# EAGLE schematic lost60V3 (EAGLE 9.6.0)

## Sheet 1 of 8
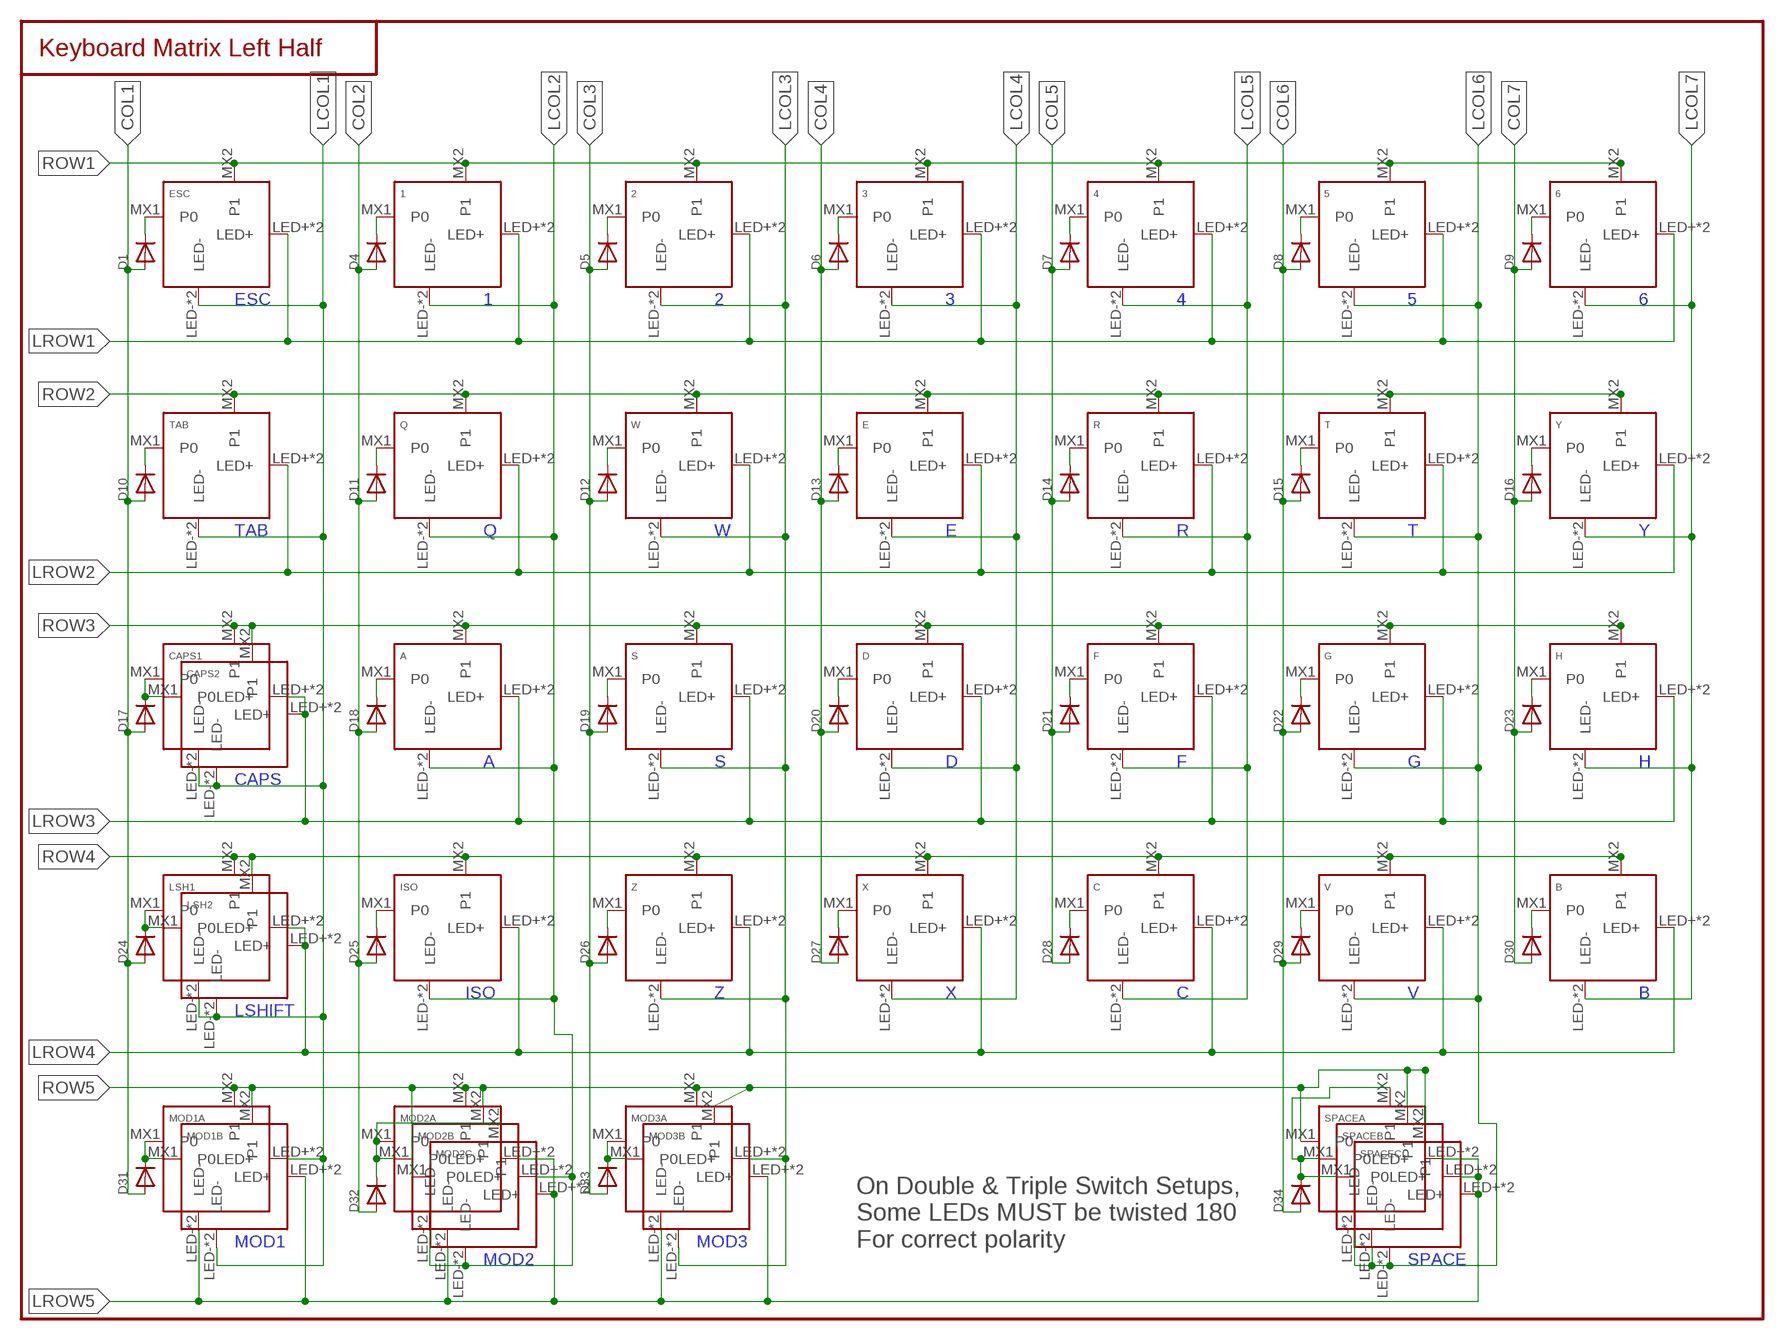
[diagram p0: schematic, sheet 1]

### Parts
1  KEYSWITCH-THTSMDLED-MX-1U-THTSMDLED  [MX-1U-THTSMDLED]
2  KEYSWITCH-THTSMDLED-MX-1U-THTSMDLED  [MX-1U-THTSMDLED]
3  KEYSWITCH-THTSMDLED-MX-1U-THTSMDLED  [MX-1U-THTSMDLED]
4  KEYSWITCH-THTSMDLED-MX-1U-THTSMDLED  [MX-1U-THTSMDLED]
5  KEYSWITCH-THTSMDLED-MX-1U-THTSMDLED  [MX-1U-THTSMDLED]
6  KEYSWITCH-THTSMDLED-MX-1U-THTSMDLED  [MX-1U-THTSMDLED]
A  KEYSWITCH-THTSMDLED-MX-1U-THTSMDLED  [MX-1U-THTSMDLED]
B  KEYSWITCH-THTSMDLED-MX-1U-THTSMDLED  [MX-1U-THTSMDLED]
C  KEYSWITCH-THTSMDLED-MX-1U-THTSMDLED  [MX-1U-THTSMDLED]
CAPS1  KEYSWITCH-THTSMDLED-MX-1U-THTSMDLED  [MX-1U-THTSMDLED]
CAPS2  KEYSWITCH-THTSMDLED-MX-1U-THTSMDLED  [MX-1U-THTSMDLED]
D  KEYSWITCH-THTSMDLED-MX-1U-THTSMDLED  [MX-1U-THTSMDLED]
D1  DIODESOD-523  [SOD-523]
D4  DIODESOD-523  [SOD-523]
D5  DIODESOD-523  [SOD-523]
D6  DIODESOD-523  [SOD-523]
D7  DIODESOD-523  [SOD-523]
D8  DIODESOD-523  [SOD-523]
D9  DIODESOD-523  [SOD-523]
D10  DIODESOD-523  [SOD-523]
D11  DIODESOD-523  [SOD-523]
D12  DIODESOD-523  [SOD-523]
D13  DIODESOD-523  [SOD-523]
D14  DIODESOD-523  [SOD-523]
D15  DIODESOD-523  [SOD-523]
D16  DIODESOD-523  [SOD-523]
D17  DIODESOD-523  [SOD-523]
D18  DIODESOD-523  [SOD-523]
D19  DIODESOD-523  [SOD-523]
D20  DIODESOD-523  [SOD-523]
D21  DIODESOD-523  [SOD-523]
D22  DIODESOD-523  [SOD-523]
D23  DIODESOD-523  [SOD-523]
D24  DIODESOD-523  [SOD-523]
D25  DIODESOD-523  [SOD-523]
D26  DIODESOD-523  [SOD-523]
D27  DIODESOD-523  [SOD-523]
D28  DIODESOD-523  [SOD-523]
D29  DIODESOD-523  [SOD-523]
D30  DIODESOD-523  [SOD-523]
D31  DIODESOD-523  [SOD-523]
D32  DIODESOD-523  [SOD-523]
D33  DIODESOD-523  [SOD-523]
D34  DIODESOD-523  [SOD-523]
E  KEYSWITCH-THTSMDLED-MX-1U-THTSMDLED  [MX-1U-THTSMDLED]
ESC  KEYSWITCH-THTSMDLED-MX-1U-THTSMDLED  [MX-1U-THTSMDLED]
F  KEYSWITCH-THTSMDLED-MX-1U-THTSMDLED  [MX-1U-THTSMDLED]
G  KEYSWITCH-THTSMDLED-MX-1U-THTSMDLED  [MX-1U-THTSMDLED]
H  KEYSWITCH-THTSMDLED-MX-1U-THTSMDLED  [MX-1U-THTSMDLED]
ISO  KEYSWITCH-THTSMDLED-MX-1U-THTSMDLED  [MX-1U-THTSMDLED]
LSH1  KEYSWITCH-THTSMDLED-MX-1U-THTSMDLED  [MX-1U-THTSMDLED]
LSH2  KEYSWITCH-THTSMDLED-MX-2U-THTSMDLED  [MX-2U-THTSMDLED]
MOD1A  KEYSWITCH-THTSMDLED-MX-1U-THTSMDLED  [MX-1U-THTSMDLED]
MOD1B  KEYSWITCH-THTSMDLED-MX-1U-THTSMDLED  [MX-1U-THTSMDLED]
MOD2A  KEYSWITCH-THTSMDLED-MX-1U-THTSMDLED  [MX-1U-THTSMDLED]
MOD2B  KEYSWITCH-THTSMDLED-MX-1U-THTSMDLED  [MX-1U-THTSMDLED]
MOD2C  KEYSWITCH-THTSMDLED-MX-1U-THTSMDLED  [MX-1U-THTSMDLED]
MOD3A  KEYSWITCH-THTSMDLED-MX-1U-THTSMDLED  [MX-1U-THTSMDLED]
MOD3B  KEYSWITCH-THTSMDLED-MX-1U-THTSMDLED  [MX-1U-THTSMDLED]
Q  KEYSWITCH-THTSMDLED-MX-1U-THTSMDLED  [MX-1U-THTSMDLED]
R  KEYSWITCH-THTSMDLED-MX-1U-THTSMDLED  [MX-1U-THTSMDLED]
S  KEYSWITCH-THTSMDLED-MX-1U-THTSMDLED  [MX-1U-THTSMDLED]
SPACEA  KEYSWITCH-THTSMDLED-MX-6.25U-THTSMDLED-FLIPPED  [MX-6.25U-THTSMDLED-FLIPPED]
SPACEB  KEYSWITCH-THTSMDLED-MX-7U-THTSMDLED-FLIPPED  [MX-7U-THTSMDLED-FLIPPED]
SPACEC  KEYSWITCH-THTSMDLED-MX-7U-THTSMDLED-FLIPPED  [MX-7U-THTSMDLED-FLIPPED]
T  KEYSWITCH-THTSMDLED-MX-1U-THTSMDLED  [MX-1U-THTSMDLED]
TAB  KEYSWITCH-THTSMDLED-MX-1U-THTSMDLED  [MX-1U-THTSMDLED]
V  KEYSWITCH-THTSMDLED-MX-1U-THTSMDLED  [MX-1U-THTSMDLED]
W  KEYSWITCH-THTSMDLED-MX-1U-THTSMDLED  [MX-1U-THTSMDLED]
X  KEYSWITCH-THTSMDLED-MX-1U-THTSMDLED  [MX-1U-THTSMDLED]
Y  KEYSWITCH-THTSMDLED-MX-1U-THTSMDLED  [MX-1U-THTSMDLED]
Z  KEYSWITCH-THTSMDLED-MX-1U-THTSMDLED  [MX-1U-THTSMDLED]

### Nets
COL1: D1.A D10.A D17.A D24.A D31.A ; also sheet 4
COL2: D4.A D11.A D18.A D25.A D32.A ; also sheet 4
COL3: D5.A D12.A D19.A D26.A D33.A ; also sheet 4
COL4: D6.A D13.A D20.A D27.A ; also sheet 4
COL5: D7.A D14.A D21.A D28.A ; also sheet 4
COL6: D8.A D15.A D22.A D29.A D34.A ; also sheet 4
COL7: D9.A D16.A D23.A D30.A ; also sheet 4
LCOL1: CAPS1.LED- CAPS1.SMDLED-(LED-) CAPS2.LED- CAPS2.SMDLED-(LED-) ESC.LED- ESC.SMDLED-(LED-) LSH1.LED- LSH1.SMDLED-(LED-) LSH2.LED- LSH2.SMDLED-(LED-) MOD1A.LED+ MOD1A.SMDLED+(LED+) MOD1B.LED- MOD1B.SMDLED-(LED-) TAB.LED- TAB.SMDLED-(LED-) ; also sheet 8
LCOL2: 1.LED- 1.SMDLED-(LED-) A.LED- A.SMDLED-(LED-) ISO.LED- ISO.SMDLED-(LED-) MOD2A.LED- MOD2A.SMDLED-(LED-) MOD2B.LED+ MOD2B.SMDLED+(LED+) MOD2C.LED- MOD2C.SMDLED-(LED-) Q.LED- Q.SMDLED-(LED-) ; also sheet 8
LCOL3: 2.LED- 2.SMDLED-(LED-) MOD3A.LED+ MOD3A.SMDLED+(LED+) MOD3B.LED- MOD3B.SMDLED-(LED-) S.LED- S.SMDLED-(LED-) W.LED- W.SMDLED-(LED-) Z.LED- Z.SMDLED-(LED-) ; also sheet 8
LCOL4: 3.LED- 3.SMDLED-(LED-) D.LED- D.SMDLED-(LED-) E.LED- E.SMDLED-(LED-) X.LED- X.SMDLED-(LED-) ; also sheet 8
LCOL5: 4.LED- 4.SMDLED-(LED-) C.LED- C.SMDLED-(LED-) F.LED- F.SMDLED-(LED-) R.LED- R.SMDLED-(LED-) ; also sheet 8
LCOL6: 5.LED- 5.SMDLED-(LED-) G.LED- G.SMDLED-(LED-) SPACEA.LED- SPACEA.SMDLED-(LED-) SPACEB.LED- SPACEB.SMDLED-(LED-) SPACEC.LED- SPACEC.SMDLED-(LED-) T.LED- T.SMDLED-(LED-) V.LED- V.SMDLED-(LED-) ; also sheet 8
LCOL7: 6.LED- 6.SMDLED-(LED-) B.LED- B.SMDLED-(LED-) H.LED- H.SMDLED-(LED-) Y.LED- Y.SMDLED-(LED-) ; also sheet 8
LROW1: 1.LED+ 1.SMDLED+(LED+) 2.LED+ 2.SMDLED+(LED+) 3.LED+ 3.SMDLED+(LED+) 4.LED+ 4.SMDLED+(LED+) 5.LED+ 5.SMDLED+(LED+) 6.LED+ 6.SMDLED+(LED+) ESC.LED+ ESC.SMDLED+(LED+) ; also sheet 2,8
LROW2: E.LED+ E.SMDLED+(LED+) Q.LED+ Q.SMDLED+(LED+) R.LED+ R.SMDLED+(LED+) T.LED+ T.SMDLED+(LED+) TAB.LED+ TAB.SMDLED+(LED+) W.LED+ W.SMDLED+(LED+) Y.LED+ Y.SMDLED+(LED+) ; also sheet 2,8
LROW3: A.LED+ A.SMDLED+(LED+) CAPS1.LED+ CAPS1.SMDLED+(LED+) CAPS2.LED+ CAPS2.SMDLED+(LED+) D.LED+ D.SMDLED+(LED+) F.LED+ F.SMDLED+(LED+) G.LED+ G.SMDLED+(LED+) H.LED+ H.SMDLED+(LED+) S.LED+ S.SMDLED+(LED+) ; also sheet 2,8
LROW4: B.LED+ B.SMDLED+(LED+) C.LED+ C.SMDLED+(LED+) ISO.LED+ ISO.SMDLED+(LED+) LSH1.LED+ LSH1.SMDLED+(LED+) LSH2.LED+ LSH2.SMDLED+(LED+) V.LED+ V.SMDLED+(LED+) X.LED+ X.SMDLED+(LED+) Z.LED+ Z.SMDLED+(LED+) ; also sheet 2,8
LROW5: MOD1A.LED- MOD1A.SMDLED-(LED-) MOD1B.LED+ MOD1B.SMDLED+(LED+) MOD2A.LED+ MOD2A.SMDLED+(LED+) MOD2B.LED- MOD2B.SMDLED-(LED-) MOD2C.LED+ MOD2C.SMDLED+(LED+) MOD3A.LED- MOD3A.SMDLED-(LED-) MOD3B.LED+ MOD3B.SMDLED+(LED+) SPACEA.LED+ SPACEA.SMDLED+(LED+) SPACEB.LED+ SPACEB.SMDLED+(LED+) SPACEC.LED+ SPACEC.SMDLED+(LED+) ; also sheet 2,8
N$20: D1.K(C) ESC.MX1(P0)
N$27: 1.MX1(P0) D4.K(C)
N$30: 2.MX1(P0) D5.K(C)
N$31: 3.MX1(P0) D6.K(C)
N$32: 4.MX1(P0) D7.K(C)
N$33: 5.MX1(P0) D8.K(C)
N$34: 6.MX1(P0) D9.K(C)
N$35: D10.K(C) TAB.MX1(P0)
N$36: D11.K(C) Q.MX1(P0)
N$37: D12.K(C) W.MX1(P0)
N$38: D13.K(C) E.MX1(P0)
N$39: D14.K(C) R.MX1(P0)
N$40: D15.K(C) T.MX1(P0)
N$41: D16.K(C) Y.MX1(P0)
N$42: D34.K(C) SPACEA.MX2(P1) SPACEB.MX1(P0) SPACEC.MX1(P0)
N$46: CAPS1.MX1(P0) CAPS2.MX1(P0) D17.K(C)
N$48: A.MX1(P0) D18.K(C)
N$50: D19.K(C) S.MX1(P0)
N$51: D20.K(C) D.MX1(P0)
N$52: D21.K(C) F.MX1(P0)
N$53: D23.K(C) H.MX1(P0)
N$54: D24.K(C) LSH1.MX1(P0) LSH2.MX1(P0)
N$55: D25.K(C) ISO.MX1(P0)
N$56: D26.K(C) Z.MX1(P0)
N$57: D27.K(C) X.MX1(P0)
N$58: C.MX1(P0) D28.K(C)
N$59: D29.K(C) V.MX1(P0)
N$60: B.MX1(P0) D30.K(C)
N$61: D31.K(C) MOD1A.MX1(P0) MOD1B.MX1(P0)
N$62: D32.K(C) MOD2A.MX1(P0) MOD2B.MX1(P0) MOD2C.MX2(P1)
N$63: D33.K(C) MOD3A.MX1(P0) MOD3B.MX1(P0)
N$65: D22.K(C) G.MX1(P0)
ROW1: 1.MX2(P1) 2.MX2(P1) 3.MX2(P1) 4.MX2(P1) 5.MX2(P1) 6.MX2(P1) ESC.MX2(P1) ; also sheet 2,3
ROW2: E.MX2(P1) Q.MX2(P1) R.MX2(P1) T.MX2(P1) TAB.MX2(P1) W.MX2(P1) Y.MX2(P1) ; also sheet 2,3
ROW3: A.MX2(P1) CAPS1.MX2(P1) CAPS2.MX2(P1) D.MX2(P1) F.MX2(P1) G.MX2(P1) H.MX2(P1) S.MX2(P1) ; also sheet 2,3
ROW4: B.MX2(P1) C.MX2(P1) ISO.MX2(P1) LSH1.MX2(P1) LSH2.MX2(P1) V.MX2(P1) X.MX2(P1) Z.MX2(P1) ; also sheet 2,3
ROW5: MOD1A.MX2(P1) MOD1B.MX2(P1) MOD2A.MX2(P1) MOD2B.MX2(P1) MOD2C.MX1(P0) MOD3A.MX2(P1) MOD3B.MX2(P1) SPACEA.MX1(P0) SPACEB.MX2(P1) SPACEC.MX2(P1) ; also sheet 2,3,4

### Notes on the sheet
- Keyboard Matrix Left Half
- ESC | 1 | 2 | 3 | 4 | 5 | 6
- TAB | Q | W | E | R | T | Y
- A | S | D | F | G | H
- CAPS
- ISO | Z | X | C | V | B
- LSHIFT
- MOD1 | MOD3
- On Double & Triple Switch Setups, 
  Some LEDs MUST be twisted 180 
  For correct polarity
- MOD2 | SPACE

## Sheet 2 of 8
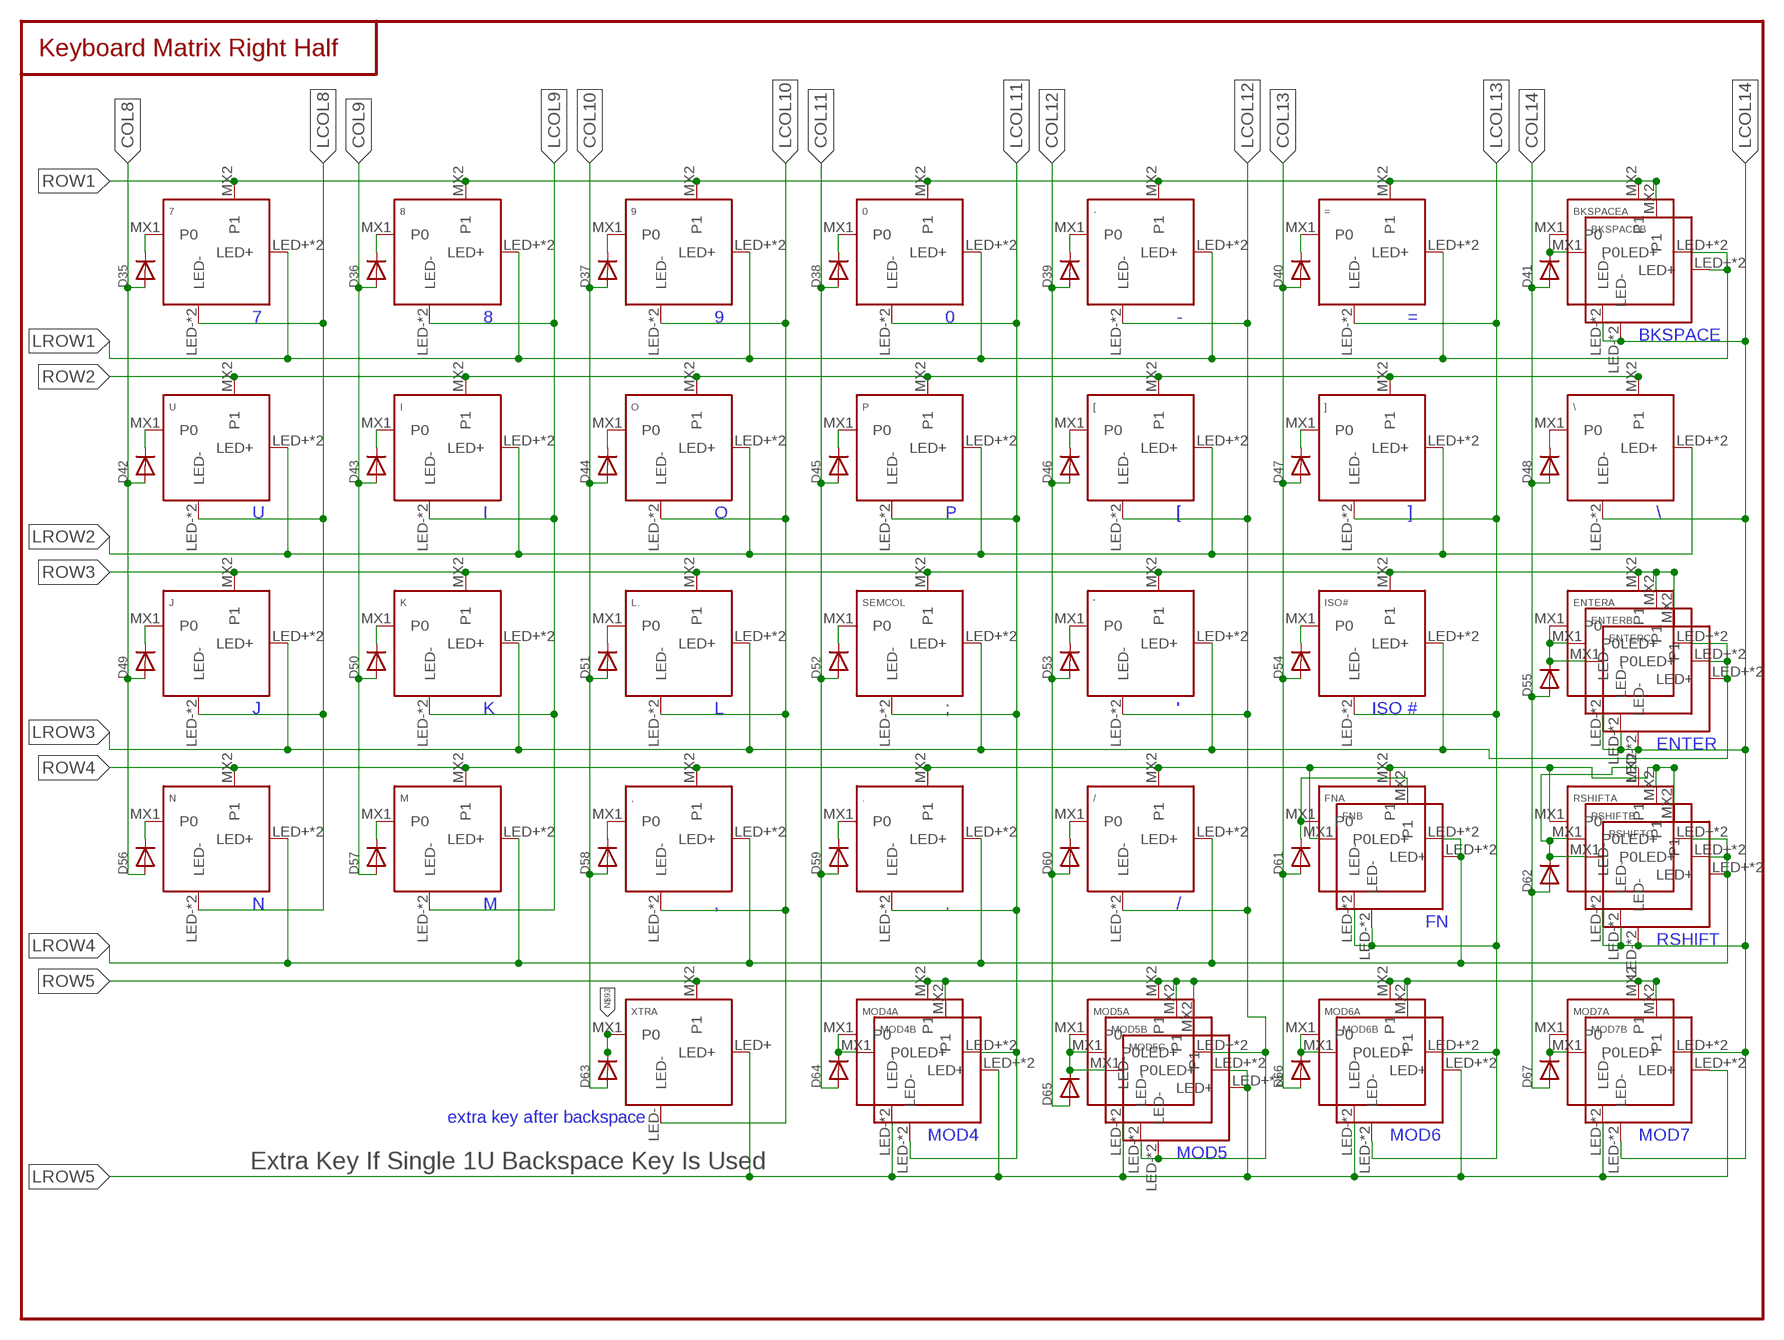
[diagram p1: schematic, sheet 2]

### Parts
0  KEYSWITCH-THTSMDLED-MX-1U-THTSMDLED  [MX-1U-THTSMDLED]
7  KEYSWITCH-THTSMDLED-MX-1U-THTSMDLED  [MX-1U-THTSMDLED]
8  KEYSWITCH-THTSMDLED-MX-1U-THTSMDLED  [MX-1U-THTSMDLED]
9  KEYSWITCH-THTSMDLED-MX-1U-THTSMDLED  [MX-1U-THTSMDLED]
'  KEYSWITCH-THTSMDLED-MX-1U-THTSMDLED  [MX-1U-THTSMDLED]
,  KEYSWITCH-THTSMDLED-MX-1U-THTSMDLED  [MX-1U-THTSMDLED]
-  KEYSWITCH-THTSMDLED-MX-1U-THTSMDLED  [MX-1U-THTSMDLED]
.  KEYSWITCH-THTSMDLED-MX-1U-THTSMDLED  [MX-1U-THTSMDLED]
/  KEYSWITCH-THTSMDLED-MX-1U-THTSMDLED  [MX-1U-THTSMDLED]
=  KEYSWITCH-THTSMDLED-MX-1U-THTSMDLED  [MX-1U-THTSMDLED]
[  KEYSWITCH-THTSMDLED-MX-1U-THTSMDLED  [MX-1U-THTSMDLED]
\  KEYSWITCH-THTSMDLED-MX-1U-THTSMDLED  [MX-1U-THTSMDLED]
]  KEYSWITCH-THTSMDLED-MX-1U-THTSMDLED  [MX-1U-THTSMDLED]
BKSPACEA  KEYSWITCH-THTSMDLED-MX-1U-THTSMDLED  [MX-1U-THTSMDLED]
BKSPACEB  KEYSWITCH-THTSMDLED-MX-2U-THTSMDLED  [MX-2U-THTSMDLED]
D35  DIODESOD-523  [SOD-523]
D36  DIODESOD-523  [SOD-523]
D37  DIODESOD-523  [SOD-523]
D38  DIODESOD-523  [SOD-523]
D39  DIODESOD-523  [SOD-523]
D40  DIODESOD-523  [SOD-523]
D41  DIODESOD-523  [SOD-523]
D42  DIODESOD-523  [SOD-523]
D43  DIODESOD-523  [SOD-523]
D44  DIODESOD-523  [SOD-523]
D45  DIODESOD-523  [SOD-523]
D46  DIODESOD-523  [SOD-523]
D47  DIODESOD-523  [SOD-523]
D48  DIODESOD-523  [SOD-523]
D49  DIODESOD-523  [SOD-523]
D50  DIODESOD-523  [SOD-523]
D51  DIODESOD-523  [SOD-523]
D52  DIODESOD-523  [SOD-523]
D53  DIODESOD-523  [SOD-523]
D54  DIODESOD-523  [SOD-523]
D55  DIODESOD-523  [SOD-523]
D56  DIODESOD-523  [SOD-523]
D57  DIODESOD-523  [SOD-523]
D58  DIODESOD-523  [SOD-523]
D59  DIODESOD-523  [SOD-523]
D60  DIODESOD-523  [SOD-523]
D61  DIODESOD-523  [SOD-523]
D62  DIODESOD-523  [SOD-523]
D63  DIODESOD-523  [SOD-523]
D64  DIODESOD-523  [SOD-523]
D65  DIODESOD-523  [SOD-523]
D66  DIODESOD-523  [SOD-523]
D67  DIODESOD-523  [SOD-523]
ENTERA  KEYSWITCH-THTSMDLED-MX-1U-THTSMDLED  [MX-1U-THTSMDLED]
ENTERB  KEYSWITCH-THTSMDLED-MX-2U-THTSMDLED  [MX-2U-THTSMDLED]
ENTERC  KEYSWITCH-THTSMDLED-MX-2U-THTSMDLED  [MX-2U-THTSMDLED]
FNA  KEYSWITCH-THTSMDLED-MX-1U-THTSMDLED  [MX-1U-THTSMDLED]
FNB  KEYSWITCH-THTSMDLED-MX-1U-THTSMDLED  [MX-1U-THTSMDLED]
I  KEYSWITCH-THTSMDLED-MX-1U-THTSMDLED  [MX-1U-THTSMDLED]
ISO#  KEYSWITCH-THTSMDLED-MX-1U-THTSMDLED  [MX-1U-THTSMDLED]
J  KEYSWITCH-THTSMDLED-MX-1U-THTSMDLED  [MX-1U-THTSMDLED]
K  KEYSWITCH-THTSMDLED-MX-1U-THTSMDLED  [MX-1U-THTSMDLED]
L.  KEYSWITCH-THTSMDLED-MX-1U-THTSMDLED  [MX-1U-THTSMDLED]
M  KEYSWITCH-THTSMDLED-MX-1U-THTSMDLED  [MX-1U-THTSMDLED]
MOD4A  KEYSWITCH-THTSMDLED-MX-1U-THTSMDLED  [MX-1U-THTSMDLED]
MOD4B  KEYSWITCH-THTSMDLED-MX-1U-THTSMDLED  [MX-1U-THTSMDLED]
MOD5A  KEYSWITCH-THTSMDLED-MX-1U-THTSMDLED  [MX-1U-THTSMDLED]
MOD5B  KEYSWITCH-THTSMDLED-MX-1U-THTSMDLED  [MX-1U-THTSMDLED]
MOD5C  KEYSWITCH-THTSMDLED-MX-1U-THTSMDLED  [MX-1U-THTSMDLED]
MOD6A  KEYSWITCH-THTSMDLED-MX-1U-THTSMDLED  [MX-1U-THTSMDLED]
MOD6B  KEYSWITCH-THTSMDLED-MX-1U-THTSMDLED  [MX-1U-THTSMDLED]
MOD7A  KEYSWITCH-THTSMDLED-MX-1U-THTSMDLED  [MX-1U-THTSMDLED]
MOD7B  KEYSWITCH-THTSMDLED-MX-1U-THTSMDLED  [MX-1U-THTSMDLED]
N  KEYSWITCH-THTSMDLED-MX-1U-THTSMDLED  [MX-1U-THTSMDLED]
O  KEYSWITCH-THTSMDLED-MX-1U-THTSMDLED  [MX-1U-THTSMDLED]
P  KEYSWITCH-THTSMDLED-MX-1U-THTSMDLED  [MX-1U-THTSMDLED]
RSHIFTA  KEYSWITCH-THTSMDLED-MX-1U-THTSMDLED  [MX-1U-THTSMDLED]
RSHIFTB  KEYSWITCH-THTSMDLED-MX-1U-THTSMDLED  [MX-1U-THTSMDLED]
RSHIFTC  KEYSWITCH-THTSMDLED-MX-2U-THTSMDLED  [MX-2U-THTSMDLED]
SEMCOL  KEYSWITCH-THTSMDLED-MX-1U-THTSMDLED  [MX-1U-THTSMDLED]
U  KEYSWITCH-THTSMDLED-MX-1U-THTSMDLED  [MX-1U-THTSMDLED]
XTRA  KEYSWITCH-THTSMDLED-MOD1  [MX-1U-THTSMDLED-MOD1]

### Nets
COL8: D35.A D42.A D49.A D56.A ; also sheet 4
COL9: D36.A D43.A D50.A D57.A ; also sheet 4
COL10: D37.A D44.A D51.A D58.A D63.A ; also sheet 4
COL11: D38.A D45.A D52.A D59.A D64.A ; also sheet 4
COL12: D39.A D46.A D53.A D60.A D65.A ; also sheet 4
COL13: D40.A D47.A D54.A D61.A D66.A ; also sheet 4
COL14: D41.A D48.A D55.A D62.A D67.A ; also sheet 4
LCOL8: 7.LED- 7.SMDLED-(LED-) J.LED- J.SMDLED-(LED-) N.LED- N.SMDLED-(LED-) U.LED- U.SMDLED-(LED-) ; also sheet 8
LCOL9: 8.LED- 8.SMDLED-(LED-) I.LED- I.SMDLED-(LED-) K.LED- K.SMDLED-(LED-) M.LED- M.SMDLED-(LED-) ; also sheet 8
LCOL10: 9.LED- 9.SMDLED-(LED-) ,.LED- ,.SMDLED-(LED-) L..LED- L..SMDLED-(LED-) O.LED- O.SMDLED-(LED-) XTRA.LED- ; also sheet 8
LCOL11: 0.LED- 0.SMDLED-(LED-) ..LED- ..SMDLED-(LED-) MOD4A.LED+ MOD4A.SMDLED+(LED+) MOD4B.LED- MOD4B.SMDLED-(LED-) P.LED- P.SMDLED-(LED-) SEMCOL.LED- SEMCOL.SMDLED-(LED-) ; also sheet 8
LCOL12: '.LED- '.SMDLED-(LED-) -.LED- -.SMDLED-(LED-) /.LED- /.SMDLED-(LED-) [.LED- [.SMDLED-(LED-) MOD5A.LED+ MOD5A.SMDLED+(LED+) MOD5B.LED- MOD5B.SMDLED-(LED-) MOD5C.LED- MOD5C.SMDLED-(LED-) ; also sheet 8
LCOL13: =.LED- =.SMDLED-(LED-) ].LED- ].SMDLED-(LED-) FNA.LED- FNA.SMDLED-(LED-) FNB.LED- FNB.SMDLED-(LED-) ISO#.LED- ISO#.SMDLED-(LED-) MOD6A.LED+ MOD6A.SMDLED+(LED+) MOD6B.LED- MOD6B.SMDLED-(LED-) ; also sheet 8
LCOL14: \.LED- \.SMDLED-(LED-) BKSPACEA.LED- BKSPACEA.SMDLED-(LED-) BKSPACEB.LED- BKSPACEB.SMDLED-(LED-) ENTERA.LED- ENTERA.SMDLED-(LED-) ENTERB.LED- ENTERB.SMDLED-(LED-) ENTERC.LED- ENTERC.SMDLED-(LED-) MOD7A.LED+ MOD7A.SMDLED+(LED+) MOD7B.LED- MOD7B.SMDLED-(LED-) RSHIFTA.LED- RSHIFTA.SMDLED-(LED-) RSHIFTB.LED- RSHIFTB.SMDLED-(LED-) RSHIFTC.LED- RSHIFTC.SMDLED-(LED-) ; also sheet 8
LROW1: 0.LED+ 0.SMDLED+(LED+) 7.LED+ 7.SMDLED+(LED+) 8.LED+ 8.SMDLED+(LED+) 9.LED+ 9.SMDLED+(LED+) -.LED+ -.SMDLED+(LED+) =.LED+ =.SMDLED+(LED+) BKSPACEA.LED+ BKSPACEA.SMDLED+(LED+) BKSPACEB.LED+ BKSPACEB.SMDLED+(LED+) ; also sheet 1,8
LROW2: [.LED+ [.SMDLED+(LED+) \.LED+ \.SMDLED+(LED+) ].LED+ ].SMDLED+(LED+) I.LED+ I.SMDLED+(LED+) O.LED+ O.SMDLED+(LED+) P.LED+ P.SMDLED+(LED+) U.LED+ U.SMDLED+(LED+) ; also sheet 1,8
LROW3: '.LED+ '.SMDLED+(LED+) ENTERA.LED+ ENTERA.SMDLED+(LED+) ENTERB.LED+ ENTERB.SMDLED+(LED+) ENTERC.LED+ ENTERC.SMDLED+(LED+) ISO#.LED+ ISO#.SMDLED+(LED+) J.LED+ J.SMDLED+(LED+) K.LED+ K.SMDLED+(LED+) L..LED+ L..SMDLED+(LED+) SEMCOL.LED+ SEMCOL.SMDLED+(LED+) ; also sheet 1,8
LROW4: ,.LED+ ,.SMDLED+(LED+) ..LED+ ..SMDLED+(LED+) /.LED+ /.SMDLED+(LED+) FNA.LED+ FNA.SMDLED+(LED+) FNB.LED+ FNB.SMDLED+(LED+) M.LED+ M.SMDLED+(LED+) N.LED+ N.SMDLED+(LED+) RSHIFTA.LED+ RSHIFTA.SMDLED+(LED+) RSHIFTB.LED+ RSHIFTB.SMDLED+(LED+) RSHIFTC.LED+ RSHIFTC.SMDLED+(LED+) ; also sheet 1,8
LROW5: MOD4A.LED- MOD4A.SMDLED-(LED-) MOD4B.LED+ MOD4B.SMDLED+(LED+) MOD5A.LED- MOD5A.SMDLED-(LED-) MOD5B.LED+ MOD5B.SMDLED+(LED+) MOD5C.LED+ MOD5C.SMDLED+(LED+) MOD6A.LED- MOD6A.SMDLED-(LED-) MOD6B.LED+ MOD6B.SMDLED+(LED+) MOD7A.LED- MOD7A.SMDLED-(LED-) MOD7B.LED+ MOD7B.SMDLED+(LED+) XTRA.LED+ ; also sheet 1,8
N$18: 7.MX1(P0) D35.K(C)
N$44: D62.K(C) RSHIFTA.MX2(P1) RSHIFTB.MX1(P0) RSHIFTC.MX1(P0)
N$66: 8.MX1(P0) D36.K(C)
N$67: 9.MX1(P0) D37.K(C)
N$68: 0.MX1(P0) D38.K(C)
N$69: -.MX1(P0) D39.K(C)
N$70: =.MX1(P0) D40.K(C)
N$71: BKSPACEA.MX1(P0) BKSPACEB.MX1(P0) D41.K(C)
N$72: D42.K(C) U.MX1(P0)
N$73: D43.K(C) I.MX1(P0)
N$74: D44.K(C) O.MX1(P0)
N$75: D45.K(C) P.MX1(P0)
N$76: [.MX1(P0) D46.K(C)
N$77: ].MX1(P0) D47.K(C)
N$78: \.MX1(P0) D48.K(C)
N$79: D49.K(C) J.MX1(P0)
N$80: D50.K(C) K.MX1(P0)
N$81: D51.K(C) L..MX1(P0)
N$82: D52.K(C) SEMCOL.MX1(P0)
N$83: '.MX1(P0) D53.K(C)
N$84: D54.K(C) ISO#.MX1(P0)
N$85: D55.K(C) ENTERA.MX1(P0) ENTERB.MX1(P0) ENTERC.MX1(P0)
N$86: D56.K(C) N.MX1(P0)
N$87: D57.K(C) M.MX1(P0)
N$88: ,.MX1(P0) D58.K(C)
N$89: ..MX1(P0) D59.K(C)
N$90: /.MX1(P0) D60.K(C)
N$91: D61.K(C) FNA.MX1(P0) FNB.MX2(P1)
N$93: D63.K(C) XTRA.MX1(P0) ; also sheet 4
N$94: D64.K(C) MOD4A.MX1(P0) MOD4B.MX1(P0)
N$95: D65.K(C) MOD5A.MX1(P0) MOD5B.MX1(P0) MOD5C.MX1(P0)
N$96: D66.K(C) MOD6A.MX1(P0) MOD6B.MX1(P0)
N$97: D67.K(C) MOD7A.MX1(P0) MOD7B.MX1(P0)
ROW1: 0.MX2(P1) 7.MX2(P1) 8.MX2(P1) 9.MX2(P1) -.MX2(P1) =.MX2(P1) BKSPACEA.MX2(P1) BKSPACEB.MX2(P1) ; also sheet 1,3
ROW2: [.MX2(P1) \.MX2(P1) ].MX2(P1) I.MX2(P1) O.MX2(P1) P.MX2(P1) U.MX2(P1) ; also sheet 1,3
ROW3: '.MX2(P1) ENTERA.MX2(P1) ENTERB.MX2(P1) ENTERC.MX2(P1) ISO#.MX2(P1) J.MX2(P1) K.MX2(P1) L..MX2(P1) SEMCOL.MX2(P1) ; also sheet 1,3
ROW4: ,.MX2(P1) ..MX2(P1) /.MX2(P1) FNA.MX2(P1) FNB.MX1(P0) M.MX2(P1) N.MX2(P1) RSHIFTA.MX1(P0) RSHIFTB.MX2(P1) RSHIFTC.MX2(P1) ; also sheet 1,3
ROW5: MOD4A.MX2(P1) MOD4B.MX2(P1) MOD5A.MX2(P1) MOD5B.MX2(P1) MOD5C.MX2(P1) MOD6A.MX2(P1) MOD6B.MX2(P1) MOD7A.MX2(P1) MOD7B.MX2(P1) XTRA.MX2(P1) ; also sheet 1,3,4

### Notes on the sheet
- Keyboard Matrix Right Half
- 7 | 8 | 9 | 0 | - | =
- BKSPACE
- U | I | O | P | [ | ] | \\
- J | K | L | ; | ' | ISO #
- ENTER
- N | M | , | . | /
- FN
- RSHIFT
- extra key after backspace
- MOD4 | MOD6 | MOD7
- MOD5
- Extra Key If Single 1U Backspace Key Is Used

## Sheet 3 of 8
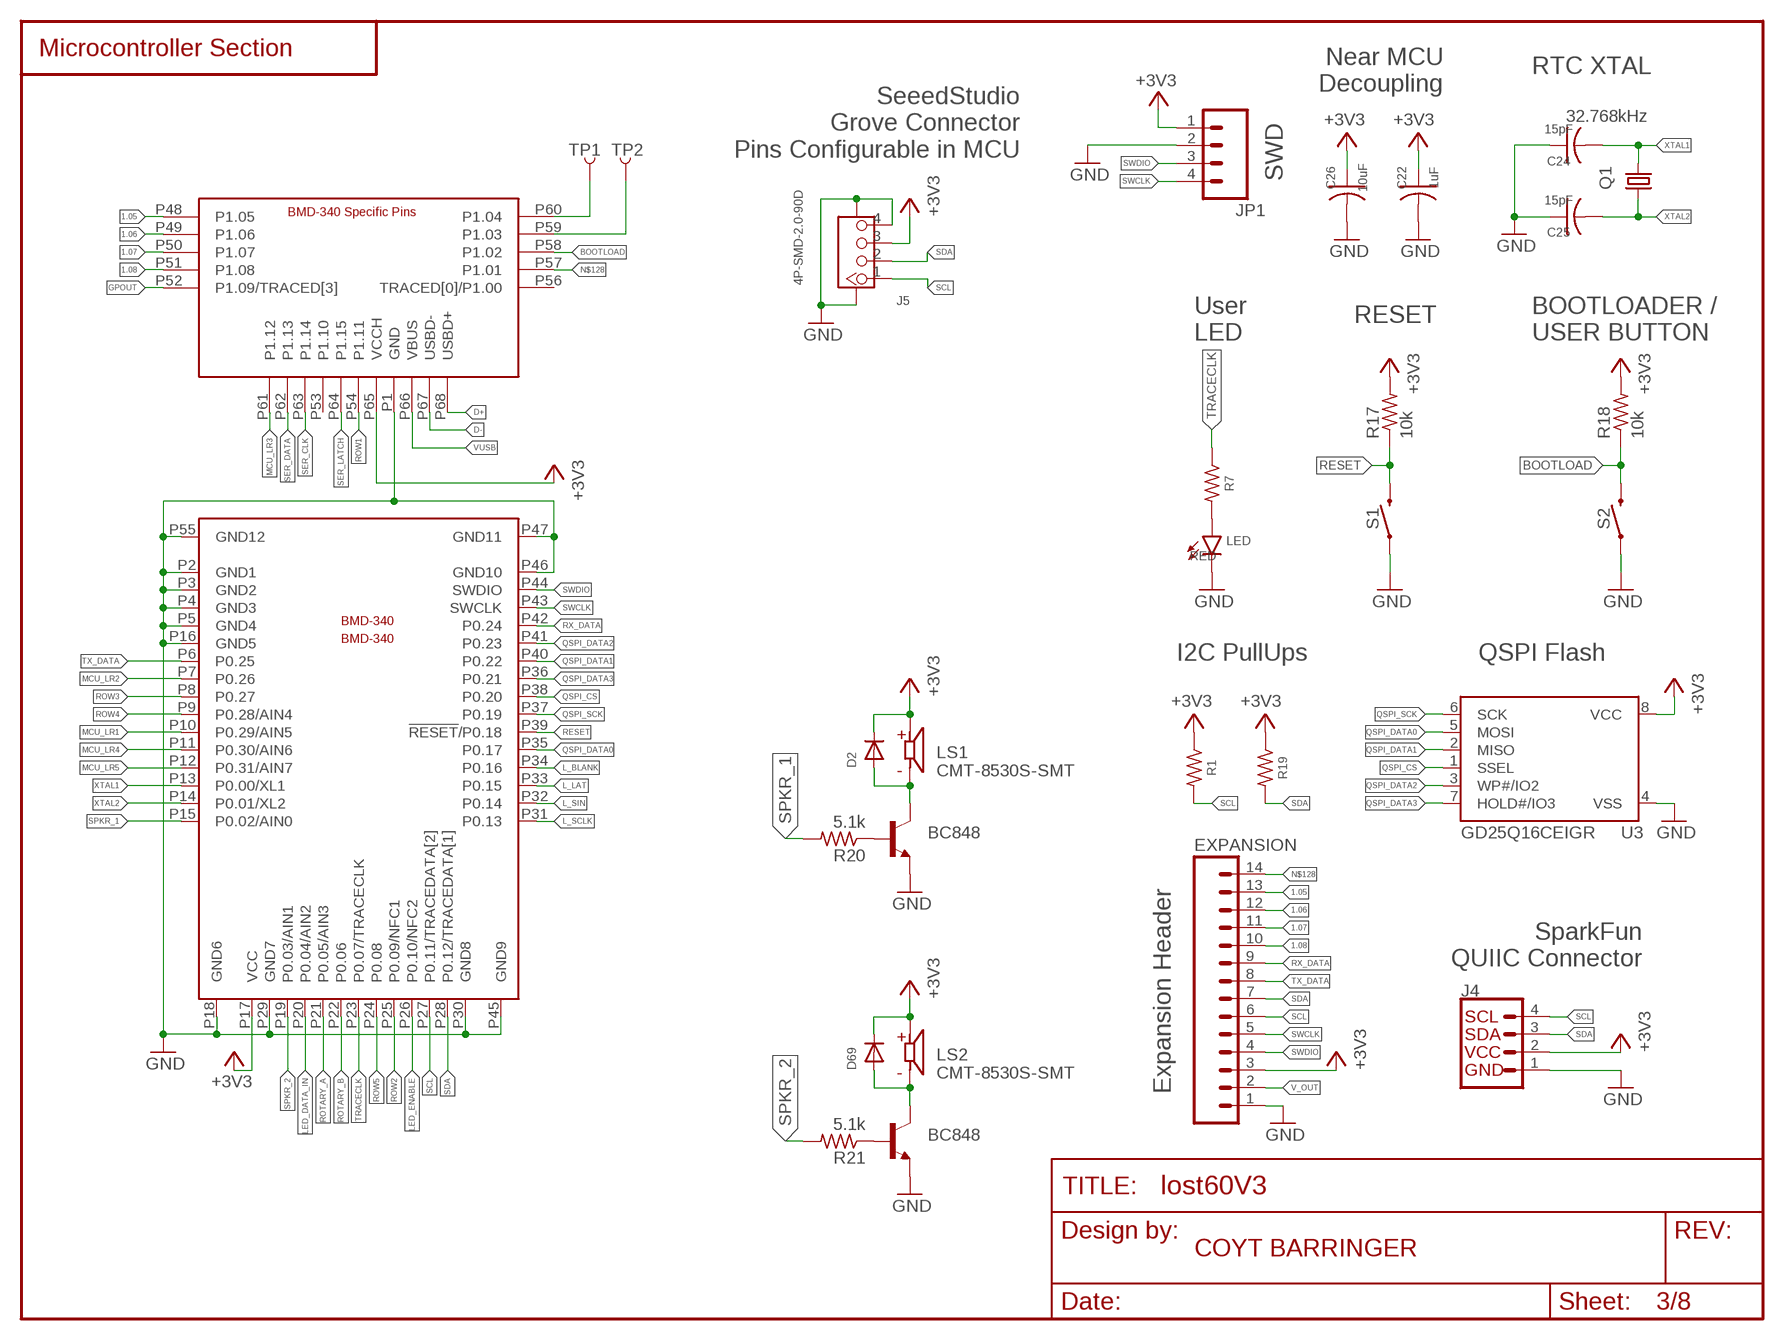
[diagram p2: schematic, sheet 3]

### Parts
BMD-340  BMD-340  [BMD-340]
C22  1uF  C-USC0603K  [C0603K]
C24  15pF  C-USC0603K  [C0603K]
C25  15pF  C-USC0603K  [C0603K]
C26  10uF  C-USC0603K  [C0603K]
D2  DIODESOD-523  [SOD-523]
D69  DIODESOD-523  [SOD-523]
EXPANSION  M14  [1X14]
J4  QWIIC_CONNECTORJS-1MM  [1X04_1MM_RA]
J5  4P-SMD-2.0-90D  GROVE-CONNECTOR-SMD-90D(4+2P-2.0)  [HW4-SMD-2.0-90D]
JP1  M04PTH  [1X04]
LED  RED  LED0603  [LED-0603]
LS1  CMT-8530S-SMT  [CUI_CMT-8530S-SMT]
LS2  CMT-8530S-SMT  [CUI_CMT-8530S-SMT]
Q1  32.768kHz  KX-327-NHF  [3.2X1.5]
R1  1k  R-US_R0603  [R0603]
R7  1k  R-US_R0603  [R0603]
R17  10k  R-US_R0603  [R0603]
R18  10k  R-US_R0603  [R0603]
R19  1k  R-US_R0603  [R0603]
R20  5.1k  R-US_R0603  [R0603]
R21  5.1k  R-US_R0603  [R0603]
S1  MOMENTARY-SWITCH-SPST-SMD-4.6X2.8MM  [TACTILE_SWITCH_SMD_4.6X2.8MM]
S2  MOMENTARY-SWITCH-SPST-SMD-4.6X2.8MM  [TACTILE_SWITCH_SMD_4.6X2.8MM]
T6  BC848  [SOT23]
T7  BC848  [SOT23]
TP1  TEST-POINT3X5  [PAD.03X.05]
TP2  TEST-POINT3X5  [PAD.03X.05]
U3  GD25Q16CEIGR  MICROBUILDER_SPIFLASH_8PINUX  [MICROBUILDER_USON8]

### Nets
1.05: BMD-340.P48(P1.05) EXPANSION.13
1.06: BMD-340.P49(P1.06) EXPANSION.12
1.07: BMD-340.P50(P1.07) EXPANSION.11
1.08: BMD-340.P51(P1.08) EXPANSION.10
+3V1: D2.A LS1.N T6.3(C)
+3V2: D69.A LS2.N T7.3(C)
+3V3: BMD-340.P17(VCC) BMD-340.P65(VCCH) C22.1 C26.1 D2.K(C) D69.K(C) EXPANSION.3 J4.2(VCC) J5.3 JP1.1 LS1.P LS2.P R1.1 R17.2 R18.2 R19.1 U3.8(VCC) ; also sheet 4,6,8
BOOTLOAD: BMD-340.P58(P1.02) R18.1 S2.3 S2.4
D+: BMD-340.P68(USBD+) ; also sheet 7
D-: BMD-340.P67(USBD-) ; also sheet 7
GND: BMD-340.P1(GND) BMD-340.P2(GND1) BMD-340.P3(GND2) BMD-340.P4(GND3) BMD-340.P5(GND4) BMD-340.P16(GND5) BMD-340.P18(GND6) BMD-340.P29(GND7) BMD-340.P30(GND8) BMD-340.P45(GND9) BMD-340.P46(GND10) BMD-340.P47(GND11) BMD-340.P55(GND12) C22.2 C24.1 C25.1 C26.2 EXPANSION.1 J4.1(GND) J5.4 J5.SS1 J5.SS2 JP1.2 LED.C S1.1 S1.2 S2.1 S2.2 T6.2(E) T7.2(E) U3.4(VSS) ; also sheet 4,5,6,7,8
GPOUT: BMD-340.P52(P1.09/TRACED[3]) ; also sheet 6
L_BLANK: BMD-340.P34(P0.16) ; also sheet 8
L_LAT: BMD-340.P33(P0.15) ; also sheet 8
L_SCLK: BMD-340.P31(P0.13) ; also sheet 8
L_SIN: BMD-340.P32(P0.14) ; also sheet 8
LED_DATA_IN: BMD-340.P20(P0.04/AIN2) ; also sheet 5
LED_ENABLE: BMD-340.P26(P0.10/NFC2) ; also sheet 5
MCU_LR1: BMD-340.P10(P0.29/AIN5) ; also sheet 8
MCU_LR2: BMD-340.P7(P0.26) ; also sheet 8
MCU_LR3: BMD-340.P61(P1.12) ; also sheet 8
MCU_LR4: BMD-340.P11(P0.30/AIN6) ; also sheet 8
MCU_LR5: BMD-340.P12(P0.31/AIN7) ; also sheet 8
N$2: LED.A R7.2
N$28: R20.1 T6.1(B)
N$29: R21.1 T7.1(B)
N$128: BMD-340.P57(P1.01) EXPANSION.14
N$130: BMD-340.P59(P1.03) TP2.P$1
N$131: BMD-340.P60(P1.04) TP1.P$1
QSPI_CS: BMD-340.P38(P0.20) U3.1(SSEL)
QSPI_DATA0: BMD-340.P35(P0.17) U3.5(MOSI)
QSPI_DATA1: BMD-340.P40(P0.22) U3.2(MISO)
QSPI_DATA2: BMD-340.P41(P0.23) U3.3(WP#/IO2)
QSPI_DATA3: BMD-340.P36(P0.21) U3.7(HOLD#/IO3)
QSPI_SCK: BMD-340.P37(P0.19) U3.6(SCK)
RESET: BMD-340.P39(!RESET!/P0.18) R17.1 S1.3 S1.4
ROTARY_A: BMD-340.P21(P0.05/AIN3) ; also sheet 4
ROTARY_B: BMD-340.P22(P0.06) ; also sheet 4
ROW1: BMD-340.P54(P1.11) ; also sheet 1,2
ROW2: BMD-340.P25(P0.09/NFC1) ; also sheet 1,2
ROW3: BMD-340.P8(P0.27) ; also sheet 1,2
ROW4: BMD-340.P9(P0.28/AIN4) ; also sheet 1,2
ROW5: BMD-340.P24(P0.08) ; also sheet 1,2,4
RX_DATA: BMD-340.P42(P0.24) EXPANSION.9
SCL: BMD-340.P27(P0.11/TRACEDATA[2]) EXPANSION.6 J4.4(SCL) J5.1 R1.2 ; also sheet 6
SDA: BMD-340.P28(P0.12/TRACEDATA[1]) EXPANSION.7 J4.3(SDA) J5.2 R19.2 ; also sheet 6
SER_CLK: BMD-340.P63(P1.14) ; also sheet 4
SER_DATA: BMD-340.P62(P1.13) ; also sheet 4
SER_LATCH: BMD-340.P64(P1.15) ; also sheet 4
SPKR_1: BMD-340.P15(P0.02/AIN0) R20.2
SPKR_2: BMD-340.P19(P0.03/AIN1) R21.2
SWCLK: BMD-340.P43(SWCLK) EXPANSION.5 JP1.4
SWDIO: BMD-340.P44(SWDIO) EXPANSION.4 JP1.3
TRACECLK: BMD-340.P23(P0.07/TRACECLK) R7.1
TX_DATA: BMD-340.P6(P0.25) EXPANSION.8
V_OUT: EXPANSION.2 ; also sheet 5,6
VUSB: BMD-340.P66(VBUS) ; also sheet 6,7
XTAL1: BMD-340.P13(P0.00/XL1) C24.2 Q1.2
XTAL2: BMD-340.P14(P0.01/XL2) C25.2 Q1.1
Unconnected: BMD-340.P53(P1.10) BMD-340.P56(TRACED[0]/P1.00)

### Notes on the sheet
- Microcontroller Section
- RTC XTAL
- SeeedStudio
     Grove Connector
  Pins Configurable in MCU
- Near MCU 
  Decoupling
- SWD
- RESET
- User
  LED
- BOOTLOADER / 
  USER BUTTON
- I2C PullUps | QSPI Flash
- Expansion Header
- SparkFun
  QUIIC Connector

## Sheet 4 of 8
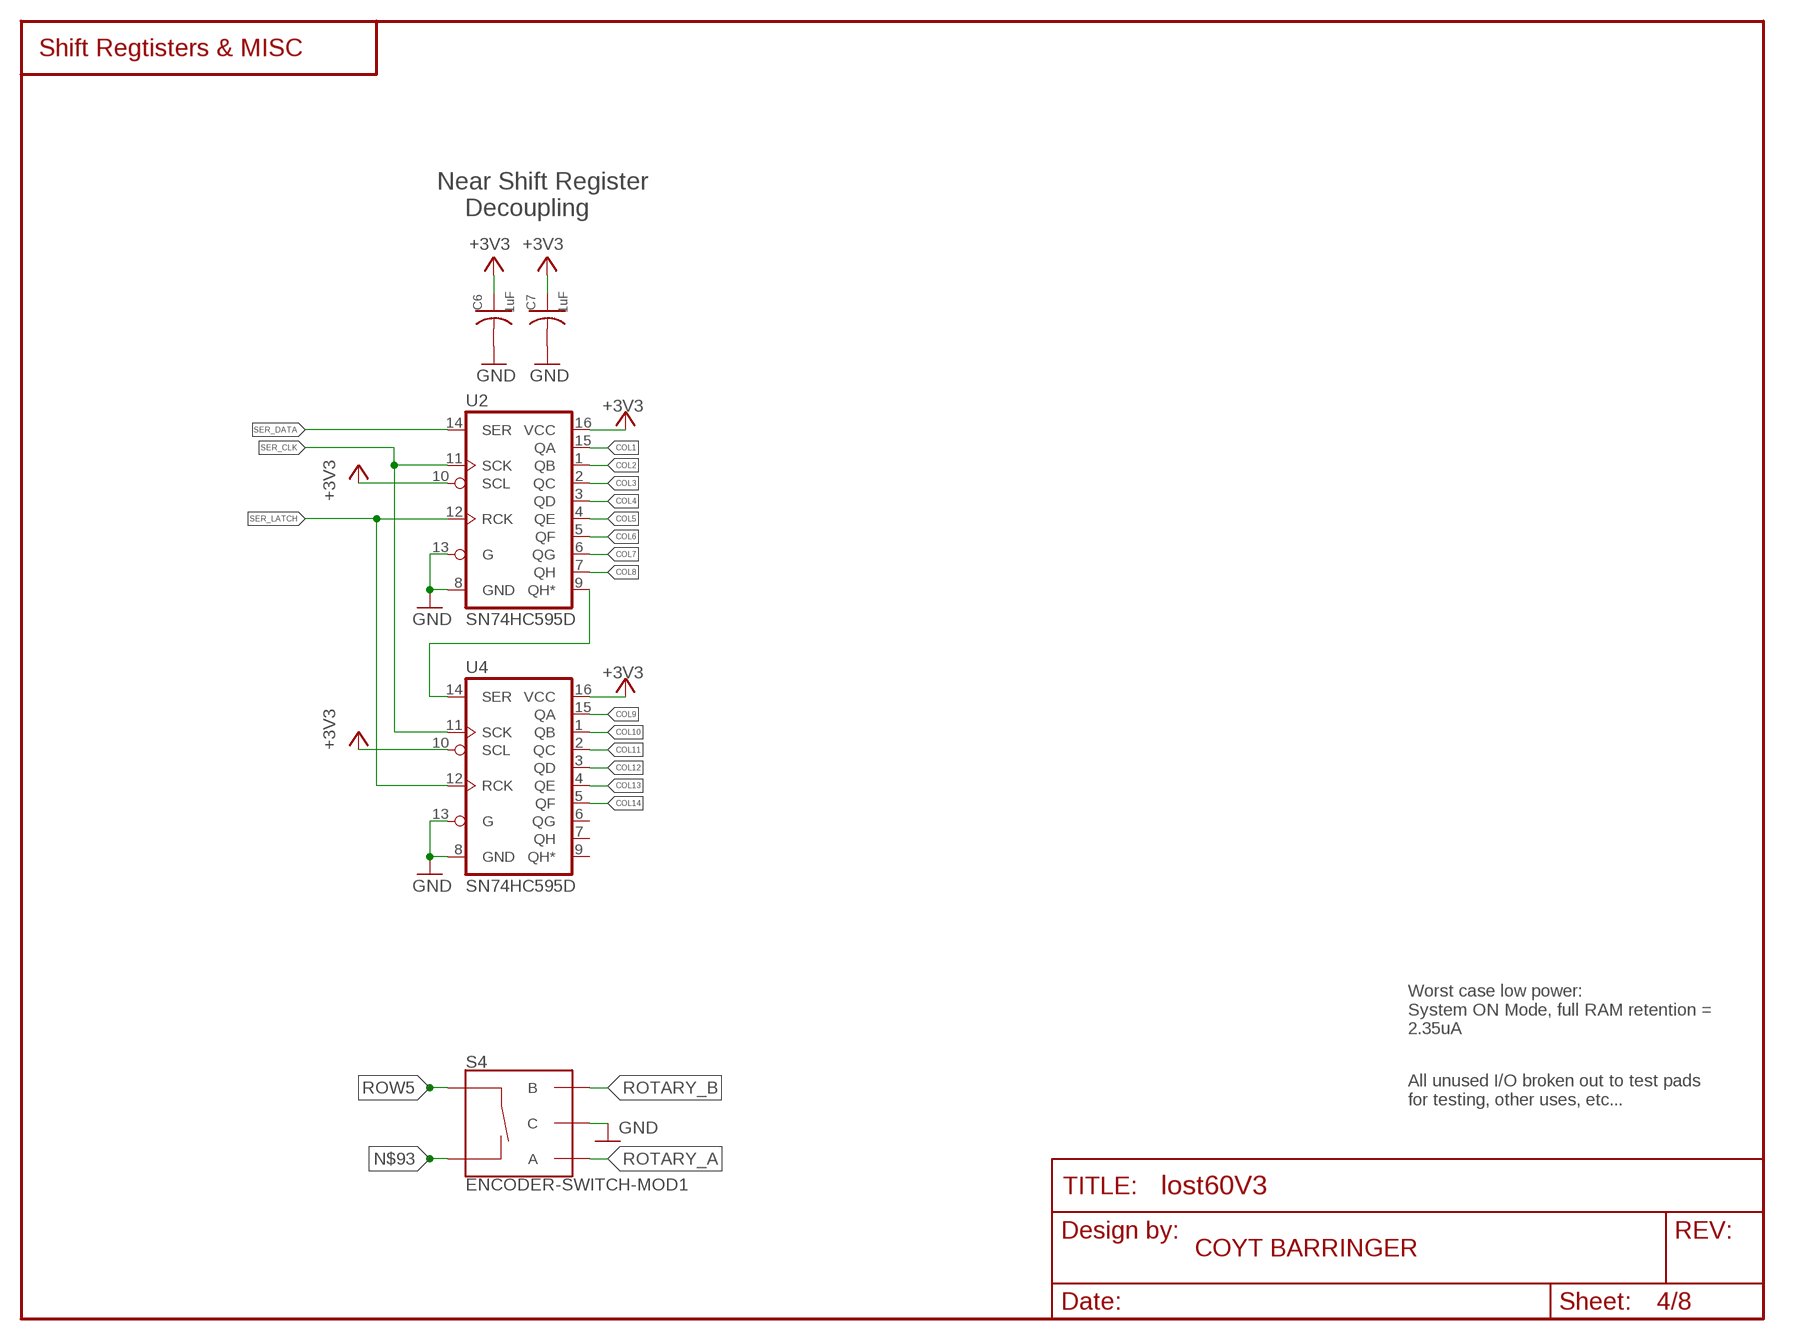
[diagram p3: schematic, sheet 4]

### Parts
C6  1uF  C-USC0603K  [C0603K]
C7  1uF  C-USC0603K  [C0603K]
S4  ENCODER-SWITCH-MOD1  [ROTARY_ENC_PLAIN-MOD1]
U2  SN74HC595D  74HC595D  [SO16]
U4  SN74HC595D  74HC595D  [SO16]

### Nets
+3V3: C6.1 C7.1 U2.10(SCL) U2.16(VCC) U4.10(SCL) U4.16(VCC) ; also sheet 3,6,8
COL1: U2.15(QA) ; also sheet 1
COL2: U2.1(QB) ; also sheet 1
COL3: U2.2(QC) ; also sheet 1
COL4: U2.3(QD) ; also sheet 1
COL5: U2.4(QE) ; also sheet 1
COL6: U2.5(QF) ; also sheet 1
COL7: U2.6(QG) ; also sheet 1
COL8: U2.7(QH) ; also sheet 2
COL9: U4.15(QA) ; also sheet 2
COL10: U4.1(QB) ; also sheet 2
COL11: U4.2(QC) ; also sheet 2
COL12: U4.3(QD) ; also sheet 2
COL13: U4.4(QE) ; also sheet 2
COL14: U4.5(QF) ; also sheet 2
GND: C6.2 C7.2 S4.C U2.8(GND) U2.13(G) U4.8(GND) U4.13(G) ; also sheet 3,5,6,7,8
N$64: U2.9(QH*) U4.14(SER)
N$93: S4.SW- ; also sheet 2
ROTARY_A: S4.A ; also sheet 3
ROTARY_B: S4.B ; also sheet 3
ROW5: S4.SW+ ; also sheet 1,2,3
SER_CLK: U2.11(SCK) U4.11(SCK) ; also sheet 3
SER_DATA: U2.14(SER) ; also sheet 3
SER_LATCH: U2.12(RCK) U4.12(RCK) ; also sheet 3
Unconnected: U4.6(QG) U4.7(QH) U4.9(QH*)

### Notes on the sheet
- Shift Regtisters & MISC
- Near Shift Register 
       Decoupling
- Worst case low power:
  System ON Mode, full RAM retention =
  2.35uA
- All unused I/O broken out to test pads
  for testing, other uses, etc...

## Sheet 5 of 8
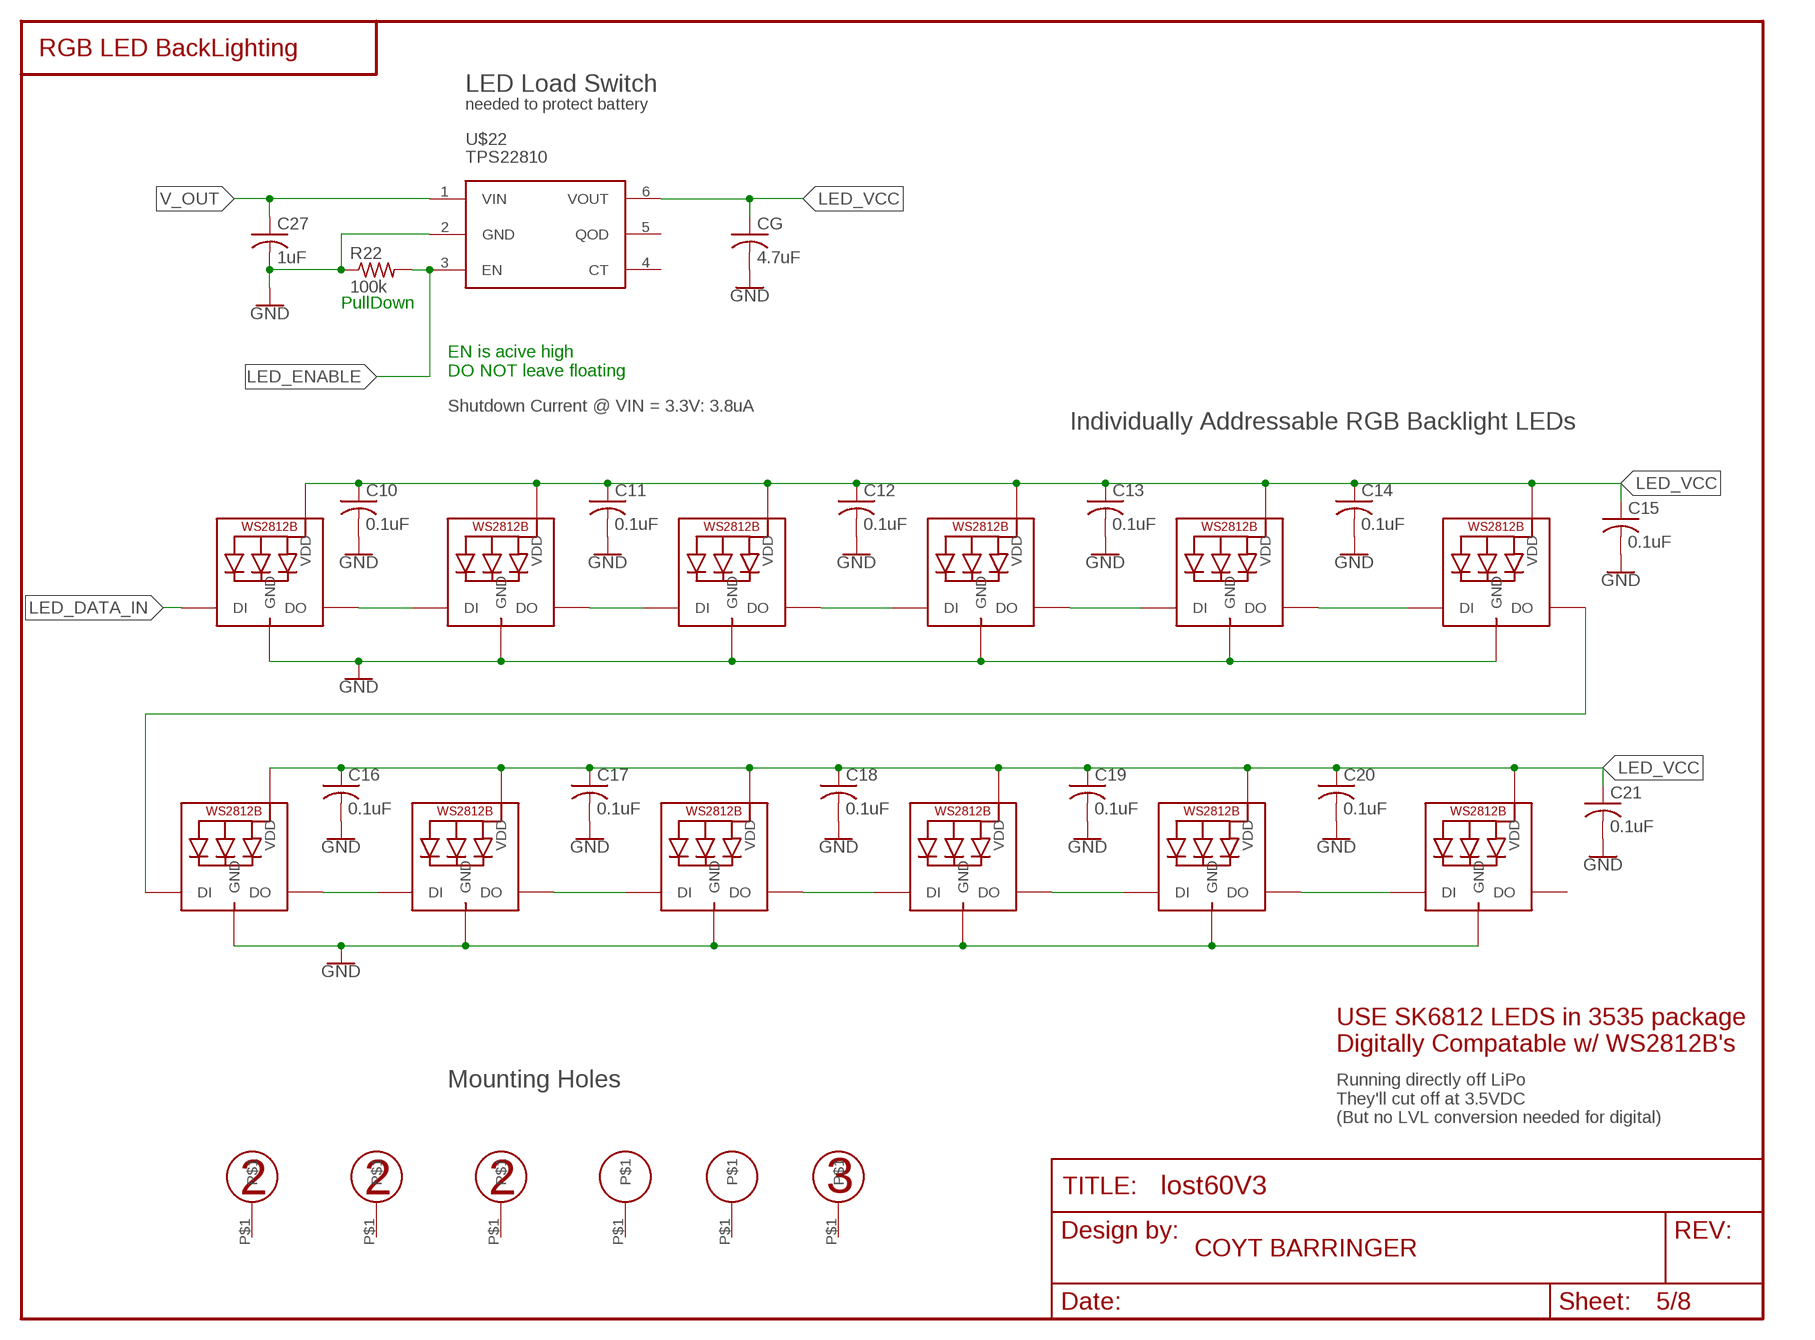
[diagram p4: schematic, sheet 5]

### Parts
C10  0.1uF  C-USC0603K  [C0603K]
C11  0.1uF  C-USC0603K  [C0603K]
C12  0.1uF  C-USC0603K  [C0603K]
C13  0.1uF  C-USC0603K  [C0603K]
C14  0.1uF  C-USC0603K  [C0603K]
C15  0.1uF  C-USC0603K  [C0603K]
C16  0.1uF  C-USC0603K  [C0603K]
C17  0.1uF  C-USC0603K  [C0603K]
C18  0.1uF  C-USC0603K  [C0603K]
C19  0.1uF  C-USC0603K  [C0603K]
C20  0.1uF  C-USC0603K  [C0603K]
C21  0.1uF  C-USC0603K  [C0603K]
C27  1uF  C-USC0603  [C0603]
CG  4.7uF  C-USC0603  [C0603]
GND  GH60HOLETYPE3  [GH60HOLETYPE3]
LED1  WS2812B3535  [LED3535]
LED2  WS2812B3535  [LED3535]
LED3  WS2812B3535  [LED3535]
LED4  WS2812B3535  [LED3535]
LED5  WS2812B3535  [LED3535]
LED6  WS2812B3535  [LED3535]
LED7  WS2812B3535  [LED3535]
LED8  WS2812B3535  [LED3535]
LED9  WS2812B3535  [LED3535]
LED10  WS2812B3535  [LED3535]
LED11  WS2812B3535  [LED3535]
LED12  WS2812B3535  [LED3535]
R22  100k  R-US_R0603  [R0603]
U$22  TPS22810  [SOT23-6]
U$125  GH60HOLE  [GH60HOLE]
U$126  GH60HOLE  [GH60HOLE]
U$130  GH60HOLETYPE2  [GH60HOLETYPE2]
U$131  GH60HOLETYPE2  [GH60HOLETYPE2]
U$132  GH60HOLETYPE2  [GH60HOLETYPE2]

### Nets
GND: C10.2 C11.2 C12.2 C13.2 C14.2 C15.2 C16.2 C17.2 C18.2 C19.2 C20.2 C21.2 C27.2 CG.2 LED1.4(GND) LED2.4(GND) LED3.4(GND) LED4.4(GND) LED5.4(GND) LED6.4(GND) LED7.4(GND) LED8.4(GND) LED9.4(GND) LED10.4(GND) LED11.4(GND) LED12.4(GND) R22.1 U$22.2(GND) ; also sheet 3,4,6,7,8
LED_DATA_IN: LED4.1(DI) ; also sheet 3
LED_ENABLE: R22.2 U$22.3(EN) ; also sheet 3
LED_VCC: C10.1 C11.1 C12.1 C13.1 C14.1 C15.1 C16.1 C17.1 C18.1 C19.1 C20.1 C21.1 CG.1 LED1.2(VDD) LED2.2(VDD) LED3.2(VDD) LED4.2(VDD) LED5.2(VDD) LED6.2(VDD) LED7.2(VDD) LED8.2(VDD) LED9.2(VDD) LED10.2(VDD) LED11.2(VDD) LED12.2(VDD) U$22.6(VOUT)
N$7: LED1.1(DI) LED4.3(DO)
N$8: LED1.3(DO) LED3.1(DI)
N$9: LED2.1(DI) LED3.3(DO)
N$10: LED2.3(DO) LED5.1(DI)
N$15: LED5.3(DO) LED6.1(DI)
N$21: LED6.3(DO) LED7.1(DI)
N$22: LED7.3(DO) LED8.1(DI)
N$23: LED8.3(DO) LED9.1(DI)
N$24: LED9.3(DO) LED10.1(DI)
N$25: LED10.3(DO) LED11.1(DI)
N$26: LED11.3(DO) LED12.1(DI)
V_OUT: C27.1 U$22.1(VIN) ; also sheet 3,6
Unconnected: GND.P$1 LED12.3(DO) U$22.4(CT) U$22.5(QOD) U$125.P$1 U$126.P$1 U$130.P$1 U$131.P$1 U$132.P$1

### Notes on the sheet
- RGB LED BackLighting
- LED Load Switch
- needed to protect battery
- PullDown
- EN is acive high 
  DO NOT leave floating
- Shutdown Current @ VIN = 3.3V: 3.8uA
- Individually Addressable RGB Backlight LEDs
- USE SK6812 LEDS in 3535 package
  Digitally Compatable w/ WS2812B's
- Mounting Holes
- Running directly off LiPo
  They'll cut off at 3.5VDC
  (But no LVL conversion needed for digital)

## Sheet 6 of 8
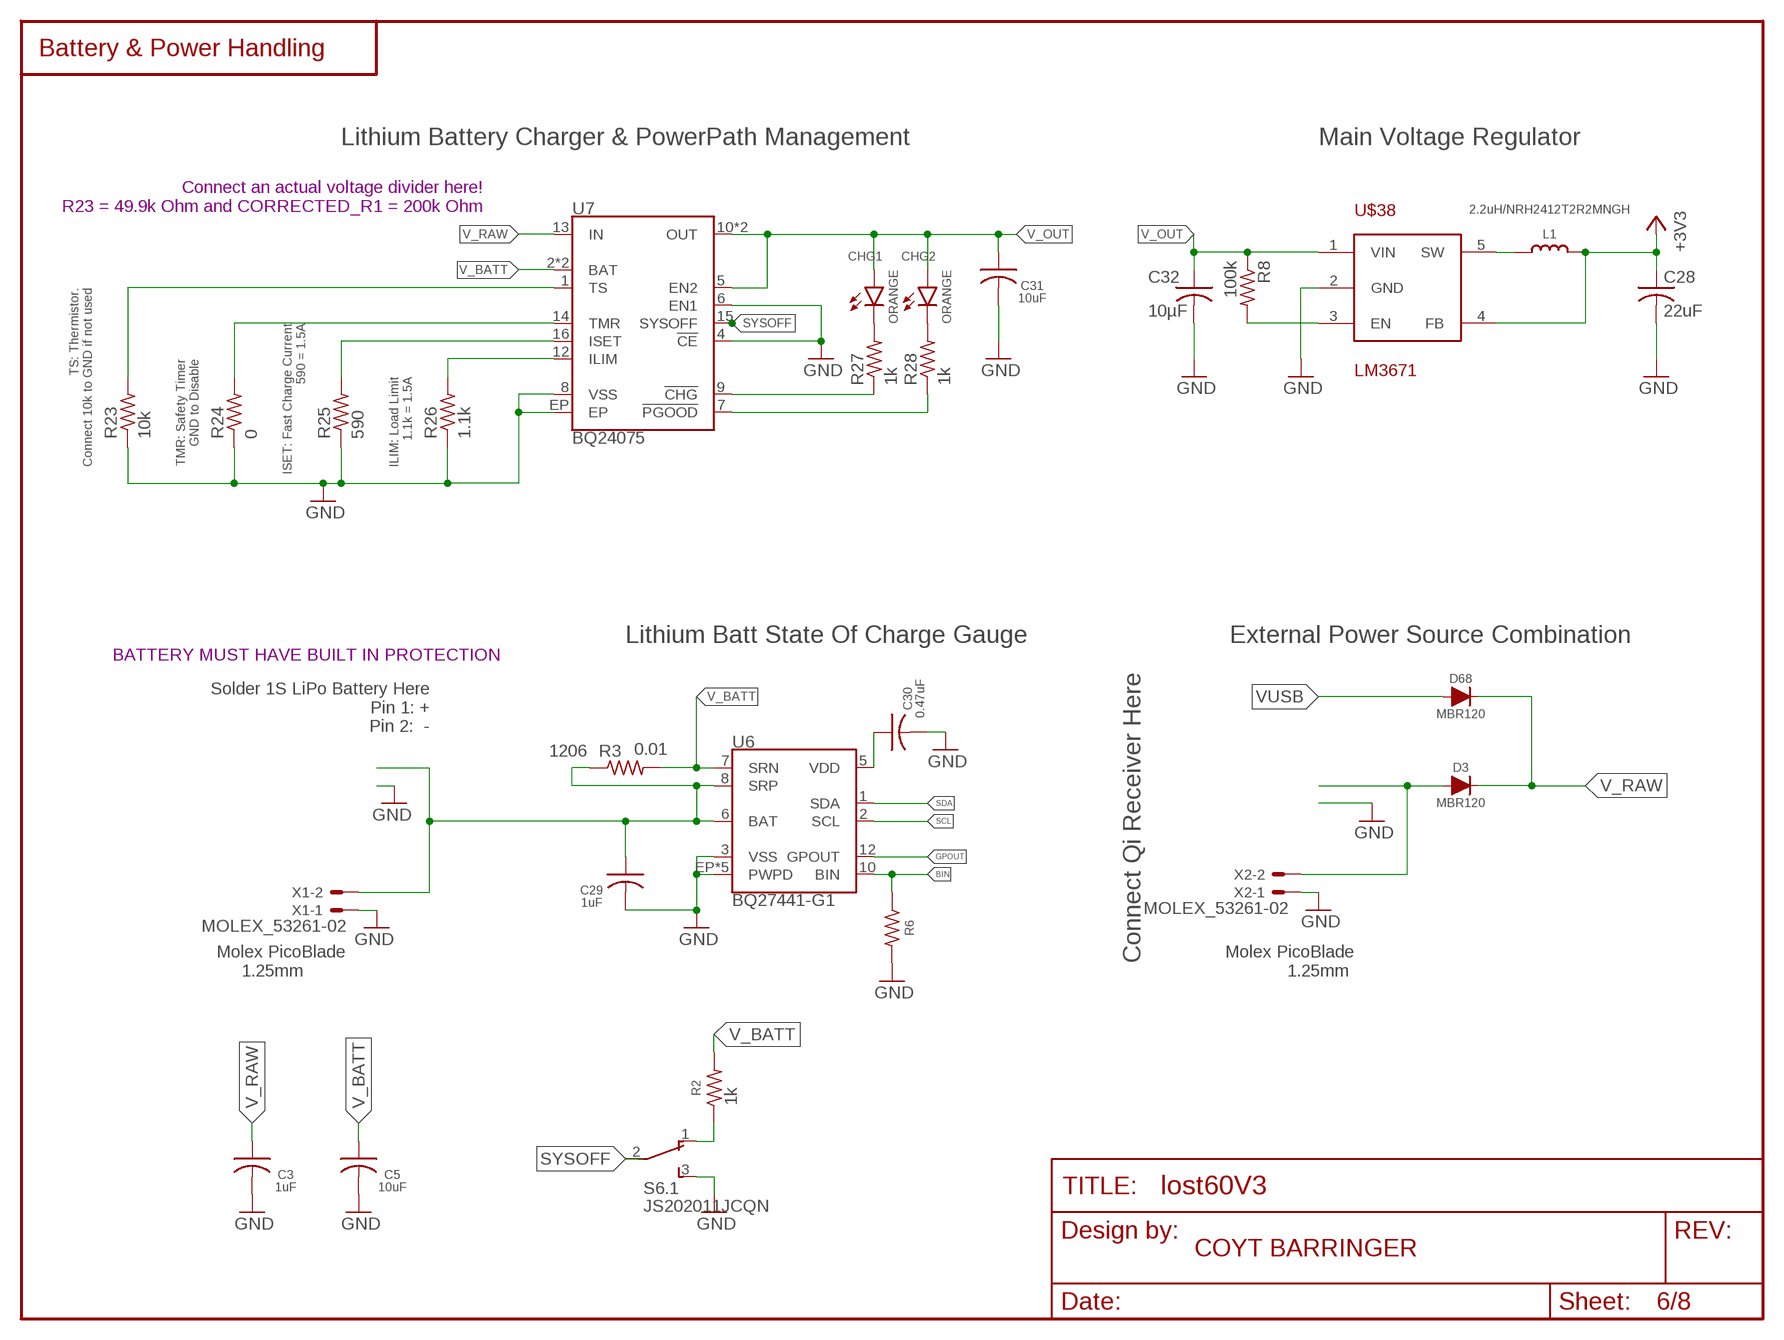
[diagram p5: schematic, sheet 6]

### Parts
C3  1uF  C-USC0603K  [C0603K]
C5  10uF  C-USC0603K  [C0603K]
C28  22uF  C-USC0603K  [C0603K]
C29  1uF  C-USC0603K  [C0603K]
C30  0.47uF  C-USC0603K  [C0603K]
C31  10uF  C-USC0603K  [C0603K]
C32  10µF  C-USC0603K  [C0603K]
CHG1  ORANGE  LED0603  [LED-0603]
CHG2  ORANGE  LED0603  [LED-0603]
D3  MBR120  D-FILL-SOD123  [SOD123]
D68  MBR120  D-FILL-SOD123  [SOD123]
L1  2.2uH/NRH2412T2R2MNGH  MICROBUILDER_INDUCTORNRH2412T  [MICROBUILDER_INDUCTOR_TAIYOYUDEN_NRH2412T]
R2  1k  R-US_R0603  [R0603]
R3  0.01  R-US_R1206  [R1206]
R6  2.7k  R-US_R0603  [R0603]
R8  100k  R-US_R0603  [R0603]
R23  10k  R-US_R0603  [R0603]
R24  0  R-US_R0603  [R0603]
R25  590  R-US_R0603  [R0603]
R26  1.1k  R-US_R0603  [R0603]
R27  1k  R-US_R0603  [R0603]
R28  1k  R-US_R0603  [R0603]
S6  JS202011JCQN  [JS202011JCQN]
U6  BQ27441-G1  [PDSO-N12]
U7  BQ24075  [PVQFN-N16]
U$38  LM3671  [SOT23-5]
X1  MOLEX_53261-02  [53261-02]
X2  MOLEX_53261-02  [53261-02]

### Nets
+3V3: C28.1 L1.2 U$38.4(FB) ; also sheet 3,4,8
BATT_IN: C29.1 R3.1 U6.6(BAT) U6.8(SRP) X1.2
BIN: R6.1 U6.10(BIN)
GND: C3.2 C5.2 C28.2 C29.2 C30.2 C31.2 C32.2 R6.2 R23.1 R24.1 R25.1 R26.1 S6.3(.1:S) U6.3(VSS) U6.EP1(PWPD) U6.EP2(PWPD) U6.EP3(PWPD) U6.EP4(PWPD) U6.EP(PWPD) U7.4(!CE!) U7.6(EN1) U7.8(VSS) U7.EP U$38.2(GND) X1.1 X2.1 ; also sheet 3,4,5,7,8
GPOUT: U6.12(GPOUT) ; also sheet 3
N$4: R2.1 S6.1(.1:O)
N$19: D3.2(A) X2.2
N$43: L1.1 U$38.5(SW)
N$45: R23.2 U7.1(TS)
N$47: R24.2 U7.14(TMR)
N$49: C30.1 U6.5(VDD)
N$92: R8.2 U$38.3(EN)
N$112: R25.2 U7.16(ISET)
N$114: R26.2 U7.12(ILIM)
N$116: R27.1 U7.9(!CHG!)
N$119: CHG1.C R27.2
N$120: CHG2.C R28.2
N$121: R28.1 U7.7(!PGOOD!)
SCL: U6.2(SCL) ; also sheet 3
SDA: U6.1(SDA) ; also sheet 3
SYSOFF: S6.2(.1:P) U7.15(SYSOFF)
V_BATT: C5.1 R2.2 R3.2 U6.7(SRN) U7.2(BAT) U7.3(BAT)
V_OUT: C31.1 C32.1 CHG1.A CHG2.A R8.1 U7.5(EN2) U7.10(OUT) U7.11(OUT) U$38.1(VIN) ; also sheet 3,5
V_RAW: C3.1 D3.1(C) D68.1(C) U7.13(IN)
VUSB: D68.2(A) ; also sheet 3,7
Unconnected: S6.4(.2:O) S6.5(.2:P) S6.6(.2:S)

### Notes on the sheet
- Battery & Power Handling
- Lithium Battery Charger & PowerPath Management | Main Voltage Regulator
- Connect an actual voltage divider here!
  R23 = 49.9k Ohm and CORRECTED_R1 = 200k Ohm
- TS: Thermistor.
  Connect 10k to GND if not used
- ISET: Fast Charge Current
  590 = 1.5A
- TMR: Safety Timer
  GND to Disable
- ILIM: Load Limit
  1.1k = 1.5A
- Lithium Batt State Of Charge Gauge | External Power Source Combination
- BATTERY MUST HAVE BUILT IN PROTECTION
- Solder 1S LiPo Battery Here
  Pin 1: +
  Pin 2:  -
- 1206
- Molex PicoBlade
       1.25mm
- Molex PicoBlade
       1.25mm
- Connect Qi Receiver Here

## Sheet 7 of 8
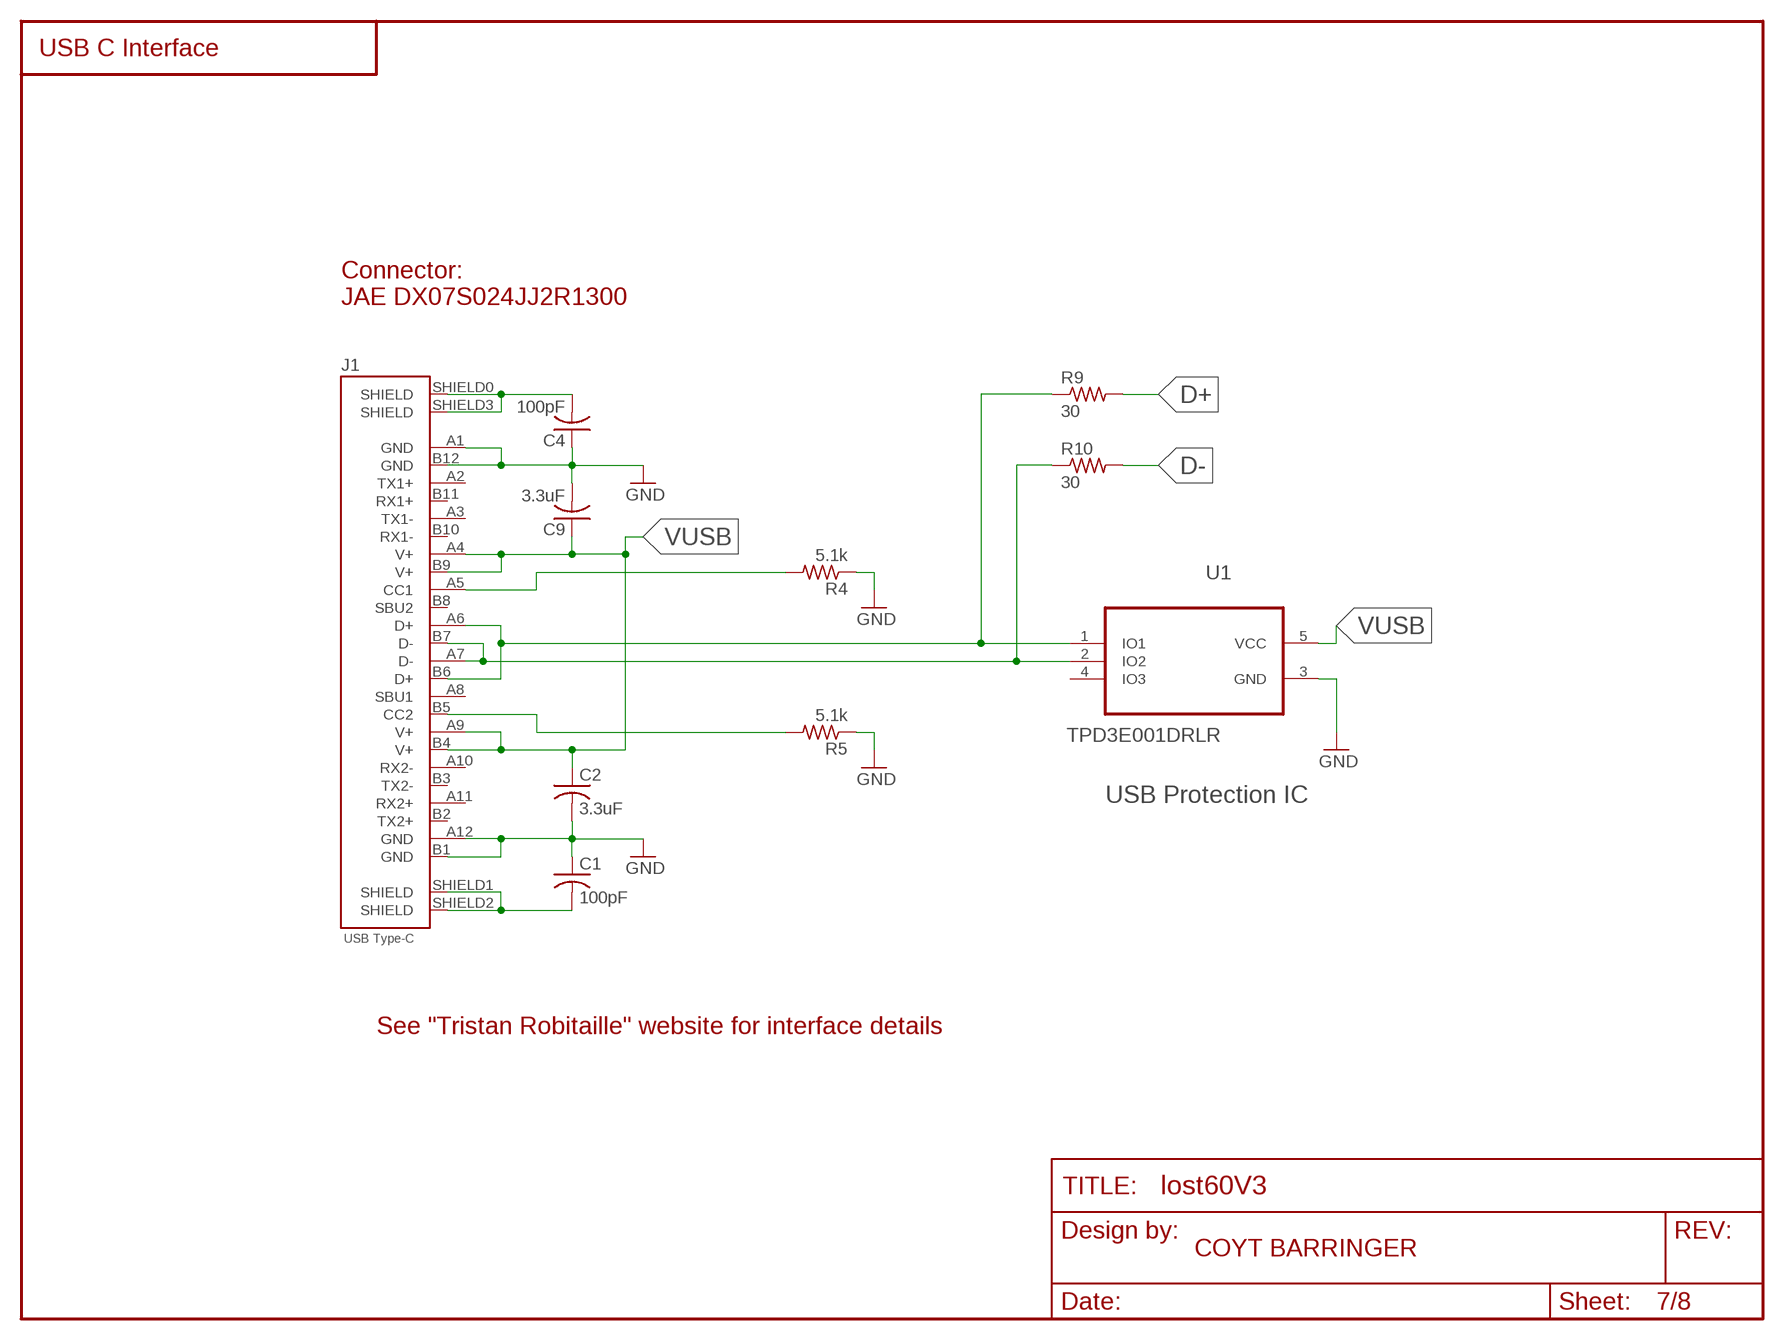
[diagram p6: schematic, sheet 7]

### Parts
C1  100pF  C-USC0603K  [C0603K]
C2  3.3uF  C-USC0603K  [C0603K]
C4  100pF  C-USC0603K  [C0603K]
C9  3.3uF  C-USC0603K  [C0603K]
J1  DX07S024JJ2_USB_TYPE-C  [DX07S0224JJ2_USB-C]
R4  5.1k  R-US_R0603  [R0603]
R5  5.1k  R-US_R0603  [R0603]
R9  30  R-US_R0603  [R0603]
R10  30  R-US_R0603  [R0603]
U1  TPD3E001DRLR  [SOT50P160X60-5N]

### Nets
D+: R9.2 ; also sheet 3
D-: R10.2 ; also sheet 3
GND: C1.1 C2.2 C4.1 C9.2 J1.A1(GND) J1.A12(GND) J1.B1(GND) J1.B12(GND) R4.1 R5.1 U1.3(GND) ; also sheet 3,4,5,6,8
N$5: C4.2 J1.SHIELD0(SHIELD) J1.SHIELD3(SHIELD)
N$6: C1.2 J1.SHIELD1(SHIELD) J1.SHIELD2(SHIELD)
N$11: J1.B5(CC2) R5.2
N$12: J1.A7(D-) J1.B7(D-) R10.1 U1.2(IO2)
N$13: J1.A6(D+) J1.B6(D+) R9.1 U1.1(IO1)
N$14: J1.A5(CC1) R4.2
VUSB: C2.1 C9.1 J1.A4(V+) J1.A9(V+) J1.B4(V+) J1.B9(V+) U1.5(VCC) ; also sheet 3,6
Unconnected: J1.A2(TX1+) J1.A3(TX1-) J1.A8(SBU1) J1.A10(RX2-) J1.A11(RX2+) J1.B2(TX2+) J1.B3(TX2-) J1.B8(SBU2) J1.B10(RX1-) J1.B11(RX1+) U1.4(IO3)

### Notes on the sheet
- USB C Interface
- Connector: 
  JAE DX07S024JJ2R1300
- USB Protection IC
- See "Tristan Robitaille" website for interface details

## Sheet 8 of 8
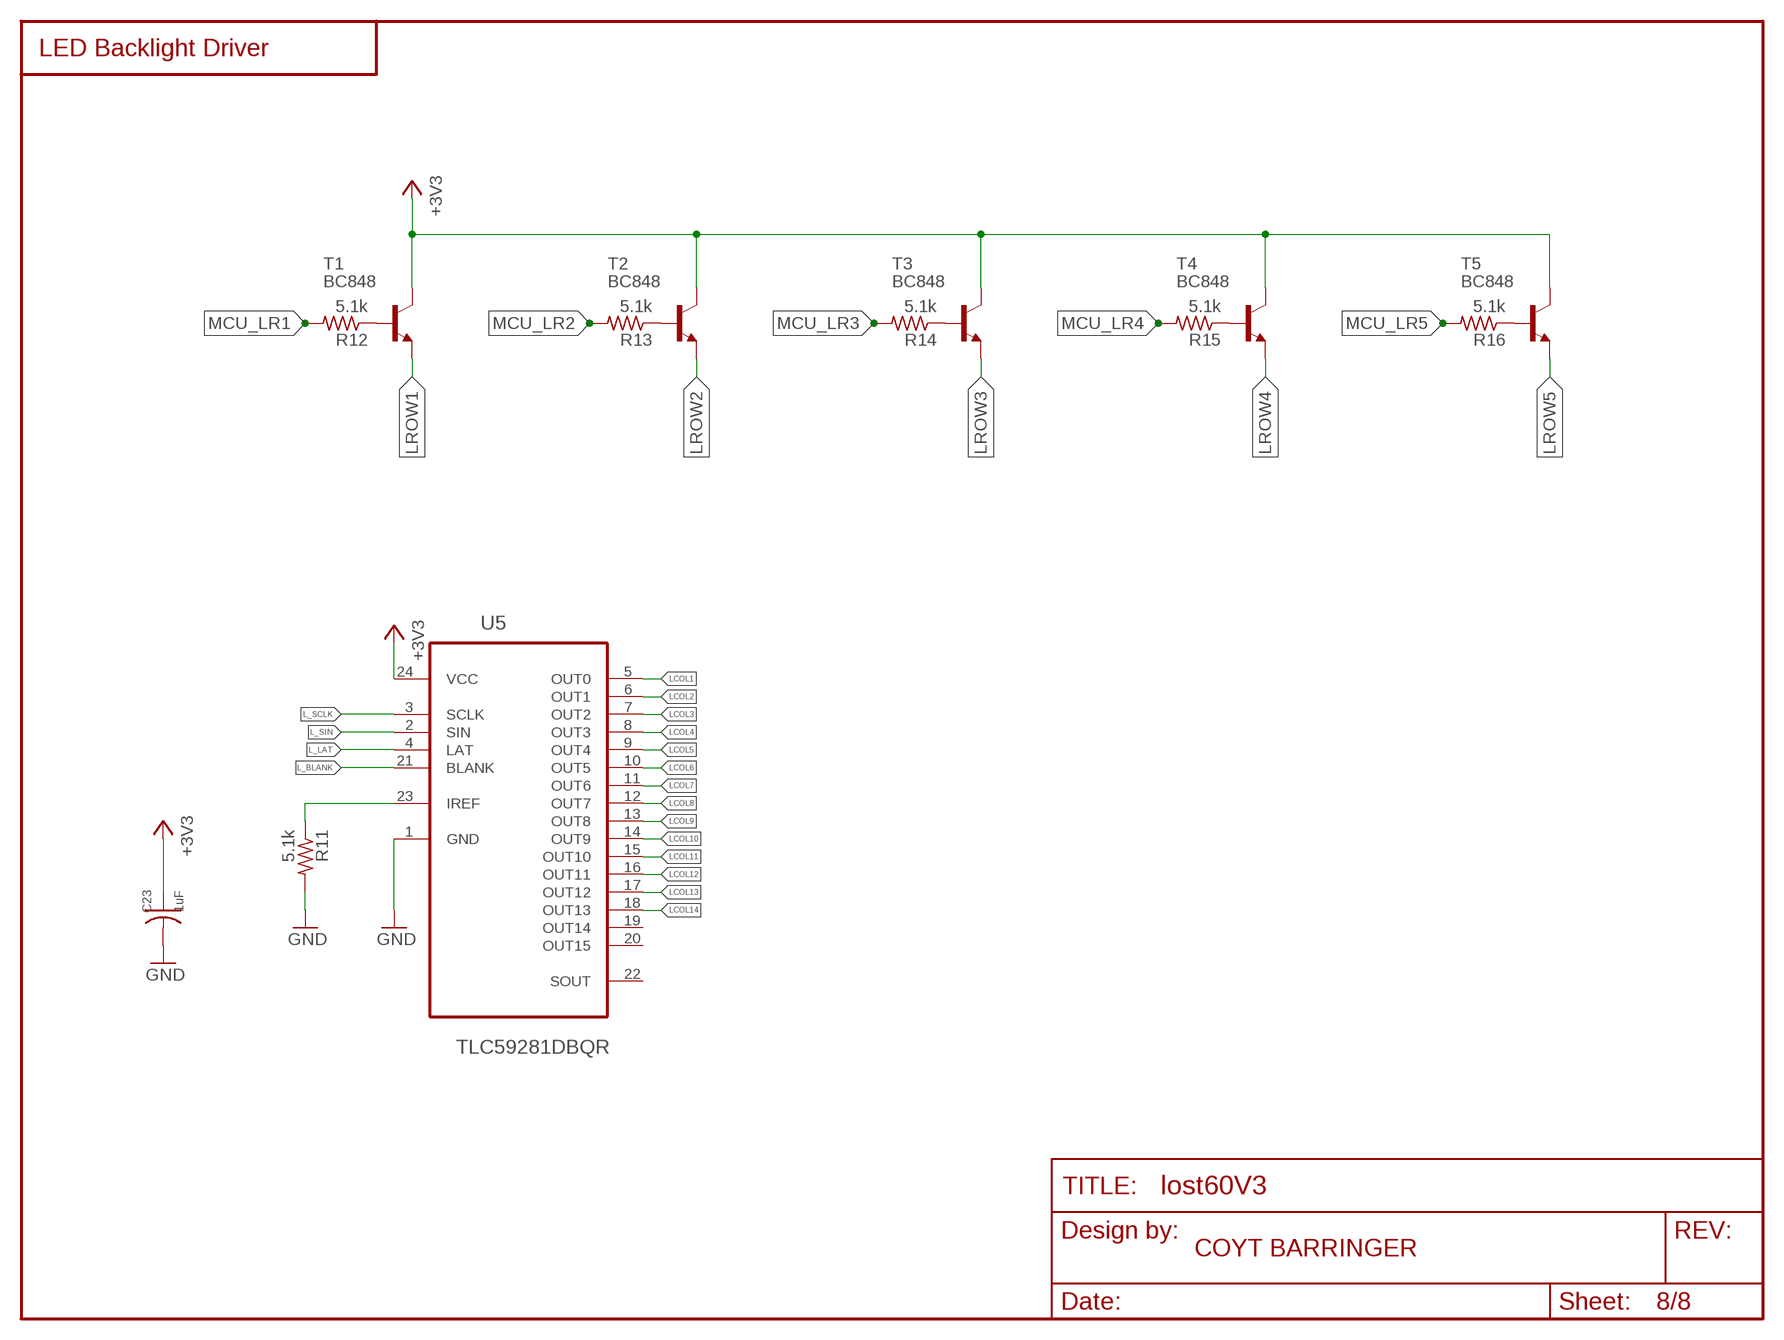
[diagram p7: schematic, sheet 8]

### Parts
C23  1uF  C-USC0603K  [C0603K]
R11  5.1k  R-US_R0603  [R0603]
R12  5.1k  R-US_R0603  [R0603]
R13  5.1k  R-US_R0603  [R0603]
R14  5.1k  R-US_R0603  [R0603]
R15  5.1k  R-US_R0603  [R0603]
R16  5.1k  R-US_R0603  [R0603]
T1  BC848  [SOT23]
T2  BC848  [SOT23]
T3  BC848  [SOT23]
T4  BC848  [SOT23]
T5  BC848  [SOT23]
U5  TLC59281DBQR  [SOP63P600X175-28N]

### Nets
+3V3: C23.1 T1.3(C) T2.3(C) T3.3(C) T4.3(C) T5.3(C) U5.24(VCC) ; also sheet 3,4,6
GND: C23.2 R11.2 U5.1(GND) ; also sheet 3,4,5,6,7
L_BLANK: U5.21(BLANK) ; also sheet 3
L_LAT: U5.4(LAT) ; also sheet 3
L_SCLK: U5.3(SCLK) ; also sheet 3
L_SIN: U5.2(SIN) ; also sheet 3
LCOL1: U5.5(OUT0) ; also sheet 1
LCOL2: U5.6(OUT1) ; also sheet 1
LCOL3: U5.7(OUT2) ; also sheet 1
LCOL4: U5.8(OUT3) ; also sheet 1
LCOL5: U5.9(OUT4) ; also sheet 1
LCOL6: U5.10(OUT5) ; also sheet 1
LCOL7: U5.11(OUT6) ; also sheet 1
LCOL8: U5.12(OUT7) ; also sheet 2
LCOL9: U5.13(OUT8) ; also sheet 2
LCOL10: U5.14(OUT9) ; also sheet 2
LCOL11: U5.15(OUT10) ; also sheet 2
LCOL12: U5.16(OUT11) ; also sheet 2
LCOL13: U5.17(OUT12) ; also sheet 2
LCOL14: U5.18(OUT13) ; also sheet 2
LROW1: T1.2(E) ; also sheet 1,2
LROW2: T2.2(E) ; also sheet 1,2
LROW3: T3.2(E) ; also sheet 1,2
LROW4: T4.2(E) ; also sheet 1,2
LROW5: T5.2(E) ; also sheet 1,2
MCU_LR1: R12.2 ; also sheet 3
MCU_LR2: R13.2 ; also sheet 3
MCU_LR3: R14.2 ; also sheet 3
MCU_LR4: R15.2 ; also sheet 3
MCU_LR5: R16.2 ; also sheet 3
N$98: R11.1 U5.23(IREF)
N$107: R12.1 T1.1(B)
N$108: R13.1 T2.1(B)
N$109: R14.1 T3.1(B)
N$110: R15.1 T4.1(B)
N$111: R16.1 T5.1(B)
Unconnected: U5.19(OUT14) U5.20(OUT15) U5.22(SOUT)

### Notes on the sheet
- LED Backlight Driver

## Library data of the parts
0 1-9 ' , - . / = [ \ ] A B BKSPACEA BKSPACEB C CAPS1 CAPS2 D E ENTERA ENTERB ENTERC ESC F FNA FNB G H I ISO ISO# J K L. LSH1 LSH2 M MOD1A MOD1B MOD2A MOD2B MOD2C MOD3A MOD3B MOD4A MOD4B MOD5A MOD5B MOD5C MOD6A MOD6B MOD7A MOD7B N O P Q R RSHIFTA RSHIFTB RSHIFTC S SEMCOL SPACEA SPACEB SPACEC T TAB U V W X Y Z = coyt:KEYSWITCH-THTSMDLED
BMD-340 = coyt:BMD-340
C1-C7 C9-C26 C28-C32 = coyt:C-US: CAPACITOR, American symbol; SPICEPREFIX: C
C27 CG = rcl:C-US: CAPACITOR, American symbol; SPICEPREFIX: C
CHG1 CHG2 LED = coyt:LED: LED (Generic) Standard schematic elements and footprints for 5mm, 3mm, 1206, and 0603 sized LEDs. Generic LEDs with no color specified.
D1 D2 D4-D67 D69 = coyt:DIODE: Diode SMADIODE - SMA Surface Mount Package 20V 1A Schottky Diode Digikey: 641-1014-6-ND DO-1N4148 - Through Hole Small Current Diode SOD-123 20V 1 A (.5mV Vf) Schottky Diode - Digikey: MBRX120TPMSCT-ND SOD-323 10V 570mA (.38mV Vf, 3ns) Schottky Diode - Digikey: ZLLS410CT-ND SOD-523 30V 30mA Schottky Diode (RB751S-40TE61) - Digikey: RB751S-40TE61CT-ND SOT23-R/W - SOT23 Package (R = Solder Paste/Reflow Ovens, W = Hand-Soldering) BAT54Film 40V 300mA - Digikey: 497-7162-1-ND
D3 D68 = semicon-smd-ipc:D-FILL-: DIODE filled
EXPANSION = SparkFun-Connectors:M14: Header 14 Standard 14-pin 0.1" header. Use with straight break away headers (SKU : PRT-00116), right angle break away headers (PRT-00553), swiss pins (PRT-00743), machine pins (PRT-00117), and female headers (PRT-00115).
GND = coyt:GH60HOLETYPE3
J1 = coyt:DX07S024JJ2_USB_TYPE-C: JAE DX07S024JJ2 USB Type-C Connector ***Footprint contains plated drill holes (2mm diameter) instead of plated slots (easier on fabhouse)*** Technical Specifications: Mating cycles: 10,000 times Contact resistance: 40mΩ (max.) Rated current: 1.25A (max.) on pins A1, A4, A9, A12, B1, B4, B5, B9 and B12 0.25A (max.) on others Rated voltage: 20Vrms Datasheet <https://www.jae.com/z-en/pdf_download_exec.cfm?param=MB-0297-3E_DX07.pdf> Digi-Key part #: 670-2794-6-ND <http://www.digikey.com/product-detail/en/jae-electronics/DX07S024JJ2R1300/670-2794-6-ND/5246069> Mouser part #: 656-DX07S024JJ2R1300 <http://ca.mouser.com/ProductDetail/JAE-Electronics/DX07S024JJ2R1300/?qs=%2fha2pyFaduhsAyGD7ZqdDeHjVi4g0c8wrw%252bV08Os%252brQ5DqW1EY3Lew%3d%3d> Manufacturer part #: DX07S024JJ2R1300; DIGIKEY#: 670-2794-6-ND; MANF: USB Type-C DX07 Series Receptacle; MANF#: DX07S024JJ2R1300; MOUSER#: 656-DX07S024JJ2R1300
J4 = coytConnectors:QWIIC_CONNECTOR: SparkFun I2C Standard Qwiic Connector An SMD 1mm pitch JST connector makes it easy and quick (get it? Qwiic?) to connect I2C devices to each other. The Qwiic system <http://www.sparkfun.com/qwiic> enables fast and solderless connection between popular platforms and various sensors and actuators. We carry 200mm <https://www.sparkfun.com/products/14204>, 100mm <https://www.sparkfun.com/products/14205>, 50mm <https://www.sparkfun.com/products/14206>, and breadboard friendly <https://www.sparkfun.com/products/14207> Qwiic cables. We also offer 10 pcs strips <https://www.sparkfun.com/products/14323> the SMD connectors. FUCK JST HOLY SHIT...this connector is a "SM04B-SRSS-TB" from their shitty as fuck website. Took long enough to find the goddamn cad model holy hell.
J5 = coyt:GROVE-CONNECTOR-SMD-90D(4+2P-2.0): 320110032 SeeedStudio Grove Connector This connector is a proprietary 4-pin 2mm part very similar to the JST-PH series. In fact, the 3D model I used here is the JST S4B-PH-SM4-TB A SMD, 90 deg, 4-pin, 2mm wire to board connector
JP1 = SparkFun-Connectors:M04: Header 4 Standard 4-pin 0.1" header. Use with straight break away headers (SKU : PRT-00116), right angle break away headers (PRT-00553), swiss pins (PRT-00743), machine pins (PRT-00117), and female headers (PRT-00115). Molex polarized connector foot print use with SKU : PRT-08231 with associated crimp pins and housings. 1MM SMD Version SKU: PRT-10208
L1 = Adafruit nRF52840 Bluefruit Feather Express Rev D:MICROBUILDER_INDUCTOR: Inductors 0603: 10nH Ceramic Inductor - microwire antenna/RF (Digikey: 712-1434-2-ND) 0805: 560nH Ceramic Inductor - RF (Digikey: 553-1047-1-ND) 270nH Ceramic Inductor - Q = 40@250MHz, +-5%, 1 Ohm DC Resistance (Digikey: 535-10506-2-ND) 1007 (2518 Metric) SMT: 10µH 10% 250mOhm 820mA 1007 Inductor (Digikey: 587-2189-1-ND) 22µH 10% 500mOhm 580mA 1007 Inductor (Digikey: 587-2190-1-ND) 47µH 10% 950mOhm 420mA 1007 Inductor (Digikey: 587-2191-1-ND) 47µH 5% 100mOhm 1A 1008 Inductor (Digikey: 732-1816-1-ND) 5.0x5.0mm (Taiyo Yuden NR5040 Series) 6.8µH 20% 2.3A 64mOhm Inductor (Digikey: 587-2374-2-ND) 5.0x5.0mm (TDK VLC5045 Series) 4.7µH 20% 3.3A 34mOhm Inductor (Digikey: 445-6526-1-ND) 6.8µH 20% 2.7A 46mOhm Inductor (Digikey: 445-6527-1-ND) 6.0x6.0mm (TDK VLC6045 Series) 4.7µH 20% 3.8A 27mOhm Inductor (Digikey: 445-6538-2-ND) 6.8µH 20% 3A 41mOhm Inductor (Digikey: 445-6540-1-ND) 6.2µH 30% 2.2A 45mOhm Inductor (Digikey: SRR5028-6R2YCT-ND) - Not TDK VLC6045 but footprint should match 6.0x6.0mm (TDK SLF6045 Series) 6.8uH 30% 2A 33mOhm Inductor (Digikey: 445-4572-1-ND, Mouser: 810-SLF645T6R8N2R0PF) 6.0x6.0mm (Sumida CDRH5D28 Series) 6.2uH 30% 1.8A 45mOhm Inductor (Digikey: 308-1542-1-ND) Taiyo Yuden NR3015T2R2M - 2.2uH 20% 1.5A (Digikey: 587-1648-2-ND, Mouser: 963-NR3015T2R2M) - Used with TI TPS62172 CoilCraft RFID Transponder Coil - MA5532-AE (For use with AS3935 Lightning Sensor) Taiyo Yuden NRH2412T2R2MNGH - 2.2uH 20% 1AA (Digikey: 587-3443-1-ND) - Used with TI LM3671 Vishay IHLP 1.0uH Molded Inductor - 24mOhm DCR, 5A, +/-20%, -55°C-125°C (Digikey: 541-1319-1-ND)
LED1-LED12 = coyt:WS2812B
LS1 LS2 = coyt:CMT-8530S-SMT: 8.5 mm, 3.6 Vo-p, 90 dB, Surface Mount (SMT), Magnetic Audio Transducer Buzzer; AVAILABILITY: Unavailable; DESCRIPTION: 8.5 mm, 3.6 Vo-p, 90 dB, Surface Mount _SMT_, Magnetic Audio Transducer Buzzer; MF: CUI; MP: CMT-8530S-SMT; PACKAGE: None; PRICE: None
Q1 = coyt:KX-327: Tuning Fork Crystals (kHz) SMD: KX327 - Serie Model Size l/w/h [mm] Frequency Range Frequency Stability Temp. Range [°C] Load Capacitance AECQ 200 availabel Datasheet KX-327VT KX-327FT KX-327RT KX-327NHT KX-327NHF KX-327L KX-327S 1.25/1.05/0.5 1.6/1.0/0.5 2.0/1.2/0.6 3.2/1.5/0.8 3.2/1.5/0.8 7.0/1.5/1.4 8.2/3.8/2.5 32,768 kHz 32,768 kHz 32,768 kHz 32,768 kHz 32,768 kHz 32,768 kHz 32,768 kHz ±10 … ±20ppm ±10 … ±20ppm ±10 … ±20ppm ±10 … ±20ppm ±10 … ±20ppm ±10 … ±20ppm ±5 … ±20ppm (*) -40°C …+85°C (*) -40°C …+85°C (*) -40°C …+85°C (*) -40°C …+85°C (*) -40°C …+125°C (*) -40°C …+85°C (*) -40°C …+85°C 7/9/12,5 7/9/12,5 7/9/12,6 7/9/12,5 9/12,5 7/9/12,5 6/12,5 - - - - yes - - KX-327VT.pdf <http://www.geyer-electronic.de/uploads/tx_userartikelfrequenz/GEYER-KX-327VT.pdf> KX-327FT.pdf <http://www.geyer-electronic.de/uploads/tx_userartikelfrequenz/GEYER-KX-327FT.pdf> KX-327RT.pdf <http://www.geyer-electronic.de/uploads/tx_userartikelfrequenz/GEYER-KX-327RT.pdf> KX-327NHT.pdf <http://www.geyer-electronic.de/uploads/tx_userartikelfrequenz/GEYER-KX-327NHT.pdf> KX-327NHF.pdf <http://www.geyer-electronic.de/uploads/tx_userartikelfrequenz/GEYER-KX-327NHF.pdf> KX-327L.pdf <http://www.geyer-electronic.de/uploads/tx_userartikelfrequenz/GEYER-KX-327L.pdf> KX-327S.pdf <http://www.geyer-electronic.de/uploads/tx_userartikelfrequenz/GEYER-KX-327S.pdf> <http://www.geyer-electronic.de/fileadmin/template/img/logo-geyer-electronic.png> Details see: http://www.geyer-electronic.de/Frequenz-Produkte.9.0.html Created 2016-06-07, Hans Locher 2016 (C) Geyer Quartz Technology KX327VT,KX327FT,KX327RT,KX327NHT,KX327NHF,KX327S,KX327L;125105;1610;2012;3215;7015;8238;1,25x1,05,1.25x1.05;1,6x1,0,1.6x1.0;2,0x1,2,2.0x1.2;3,2x1,5,3.2x1.5;8,2x3,8,8.2x3.8,7.0x1.5,7,0x1,532.768kHz
R1 R3-R22 = coyt:R-US_: RESISTOR, American symbol; SPICEPREFIX: R
R2 R23-R28 = coyt:R-US_: RESISTOR, American symbol; SPICEPREFIX: 1k
S1 S2 = coyt:MOMENTARY-SWITCH-SPST: Momentary Switch (Pushbutton) - SPST Normally-open (NO) SPST momentary switches (buttons, pushbuttons). Variants PTH-12MM - 12mm square, through-hole Momentary Pushbutton Switch - 12mm Square <https://www.sparkfun.com/products/9190> (COM-09190) PTH-6.0MM, PTH-6.0MM-KIT - 6.0mm square, through-hole Mini Pushbutton Switch <https://www.sparkfun.com/products/97> (COM-00097) KIT package intended for soldering kit's - only one side of pads' copper is exposed. PTH-RIGHT-ANGLE-KIT - Right-angle, through-hole Right Angle Tactile Button <https://www.sparkfun.com/products/10791> - Used on SparkFun BigTime Watch Kit <https://www.sparkfun.com/products/11734> SMD-12MM - 12mm square, surface-mount Tactile Button - SMD (12mm) <https://www.sparkfun.com/products/12993> (COM-12993) Used on SparkFun PicoBoard <https://www.sparkfun.com/products/11888> SMD-4.5MM - 4.5mm Square Trackball Switch Used on SparkFun Blackberry Trackballer Breakout <https://www.sparkfun.com/products/13169> SMD-4.6MMX2.8MM - 4.60mm x 2.80mm, surface mount Used on SparkFun SAMD21 Mini Breakout <https://www.sparkfun.com/products/13664> SMD-5.2MM, SMD-5.2-REDUNDANT - 5.2mm square, surface-mount Mini Pushbutton Switch - SMD <https://www.sparkfun.com/products/8720> (COM-08720) Used on Arduino Pro Mini <https://www.sparkfun.com/products/11114> REDUNDANT package connects both switch circuits together SMD-6.0X3.5MM - 6.0 x 3.5mm, surface mount Momentary Reset Switch SMD <https://www.sparkfun.com/products/8229> (COM-08229) SMD-6.2MM-TALL - 6.2mm square, surface mount Tactile Button - SMD (6mm) <https://www.sparkfun.com/products/12992> Used on SparkFun Digital Sandbox <https://www.sparkfun.com/products/12651> SMD-RIGHT-ANGLE - Right-angle, surface mount Used on SparkFun Block for Intel® Edison - Arduino <https://www.sparkfun.com/products/13036>; PROD_ID: SWCH-13065
S4 = coytElectromechanical:ENCODER-SWITCH-MOD1: Rotary Encoder w/ Select Switch Encoders rotate similarly to potentiometers, but they’re different from potentiometers in that an encoder has full rotation without limits. They output gray code so that you can tell how much and in which direction the encoder has been turned. This encoder includes a push-down select switch built into the shaft. SparkFun Products Rotary Encoder <https://www.sparkfun.com/products/9117> (COM-09117); SF_SKU: COM-09117
S6 = coytElectromechanical:JS202011JCQN; AVAILABILITY: Unavailable; DESCRIPTION: Switch Slide Dpdt 300ma 6v; MF: C&K; MP: JS202011JCQN; PACKAGE: None; PRICE: None
T1-T7 = transistor:BC848: NPN TRANSISTOR
TP1 TP2 = coyt:TEST-POINT: SparkFun Test Points Bare copper test points for troubleshooting or In-Circuit-Testing. These are used by our Production team for verifying production board runs using pogo-pins on test beds. SparkFun Products: SparkFun LSM9DS1 Breakout <https://www.sparkfun.com/products/13284> SparkFun PSOC <https://www.sparkfun.com/products/13714> SparkFun Load Cell Amplifier <https://www.sparkfun.com/products/13879>
U1 = coyt:TPD3E001DRLR: LOW-CAPACITANCE 3-CHANNEL ±15-kV ESD-PROTECTION ARRAY FOR HIGH-SPEED DATA INTERFACES; MPN: TPD3E001DRLR; OC_FARNELL: 1603422; OC_NEWARK: 41M5842; PACKAGE: SOT-5; SUPPLIER: Texas Instruments
U2 U4 = coytLogic:74*595: 8-Bit Shift Register (Serial to Parallel) Datasheet <http://cdn.sparkfun.com/datasheets/BreakoutBoards/MM74HC595.pdf> SparkFun Products SparkFun Shift Register Breakout - 74HC595 <https://www.sparkfun.com/products/10680> (BOB-10680); PROD_ID: IC-07875
U3 = coyt:MICROBUILDER_SPIFLASH_8PIN: SOIC8 SPI Flash Be careful with the size since SOIC8 flash comes in several 'widths' SOIC8 150 mil M25P16 - 16Mbit (2Mbit x 8) Serial Flash (75MHz SPI Bus), Supply: 2.7-3.6V Digikey: SOIC8 - M25P16-VMN6P-ND SOIC8 208 mil W25Q16BVSSIG - 16Mbit (2Mbit x 8) Serial Flash (104MHz SPI Bus), Supply: 2.7-3.6V Digikey: SOIC8 - W25Q16BVSSIG-ND
U5 = coyt:TLC59281DBQR: 16-Channel LED Driver; AVAILABILITY: Unavailable; DESCRIPTION: 16-Channel, Constant-Current LED Driver without LED Open Detection 24-SSOP -40 to 85; MF: Texas Instruments; MP: TLC59281DBQR; PACKAGE: SSOP-24 Texas Instruments; PRICE: None
U6 = SparkFun-IC-Power:BQ27441-G1: Texas Instruments BQ27441-G1 LiPo Battery Fuel Gauge The Texas Instruments bq27441-G1 fuel gauge is a microcontroller peripheral that provides system-side fuel gauging for single-cell Li-Ion batteries. The device requires minimal user configuration and system microcontroller firmware development. The bq27441-G1 battery fuel gauge uses the patented Impedance Track™ algorithm for fuel gauging, and provides information such as remaining battery capacity (mAh), state-of-charge (%), and battery voltage (mV). Datasheet <http://www.ti.com/product/BQ27441-G1/datasheet> SparkFun Products SparkFun Battery Babysitter <https://www.sparkfun.com/products/13777> (PRT-13777); PROD_ID: IC-13220
U7 = SparkFun-IC-Power:BQ24075: Texas Instruments BQ24075 LiPo Battery Chargerand Power-Path Management IC The bq2407x series of devices are integrated Li-Ion linear chargers and system power path management devices targeted at space-limited portable applications. The devices operate from either a USB port or an AC adapter and support charge currents up to 1.5 A. The input voltage range with input overvoltage protection supports unregulated adapters. The USB input current limit accuracy and start up sequence allow the bq2407x to meet USB-IF inrush current specifications. Additionally, the input dynamic power management (VIN-DPM) prevents the charger from crashing incorrectly configured USB sources. Datasheet <http://www.ti.com/product/BQ24075/datasheet> SparkFun Products SparkFun Battery Babysitter <https://www.sparkfun.com/products/13777> (PRT-13777); PROD_ID: IC-13219
U$22 = coyt:*TPS22810*: The TPS22810 is a single channel load switch with configurable rise time and with an integrated quick output discharge (QOD). In addition, the device features thermal shutdown to protect the device against high junction temperature. Because of this, safe operating area of the device is inherently ensured. The device contains an N-channel MOSFET that can operate over an input voltage range of 2.7 V to 18 V. SOT23-5 (DBV) package can support a maximum current of 2 A. WSON (DRV) package can support a maximum current of 3 A. The switch is controlled by an on and off input, which is capable of interfacing directly with low-voltage control signals. The configurable rise time of the device greatly reduces inrush current caused by large bulk load capacitances, thereby reducing or eliminating power supply droop. Undervoltage lock-out is used to turn off the device if the VIN voltage drops below a threshold value, ensuring that the downstream circuitry is not damaged by being supplied by a voltage lower than intended. The configurable QOD pin controls the fall time of the device to allow design flexibility for power down. The TPS22810 is available in a leaded, SOT-23 package (DBV) which allows to visually inspect solder joints, as well as a WSON package (DRV). The device is characterized for operation over the free-air temperature range of –40˚C to +105˚C.
U$38 = texas-custom:LM3671: Texas Instruments LM3671, LM3671Q 2MHz, 600mA Step-Down DC-DC Converter
U$125 U$126 = coyt:GH60HOLE
U$130-U$132 = coyt:GH60HOLETYPE2
X1 X2 = coytConnectors:MOLEX_53?-02: CONNECTOR wire to board 1.25 mm (.049 inch) pitch header; MF: MOLEX; OC_FARNELL: 1125373; OC_NEWARK: unknown
XTRA = coytElectromechanical:KEYSWITCH-THTSMDLED-MOD1